# EAGLE design QTouchShield (EAGLE 6.2)
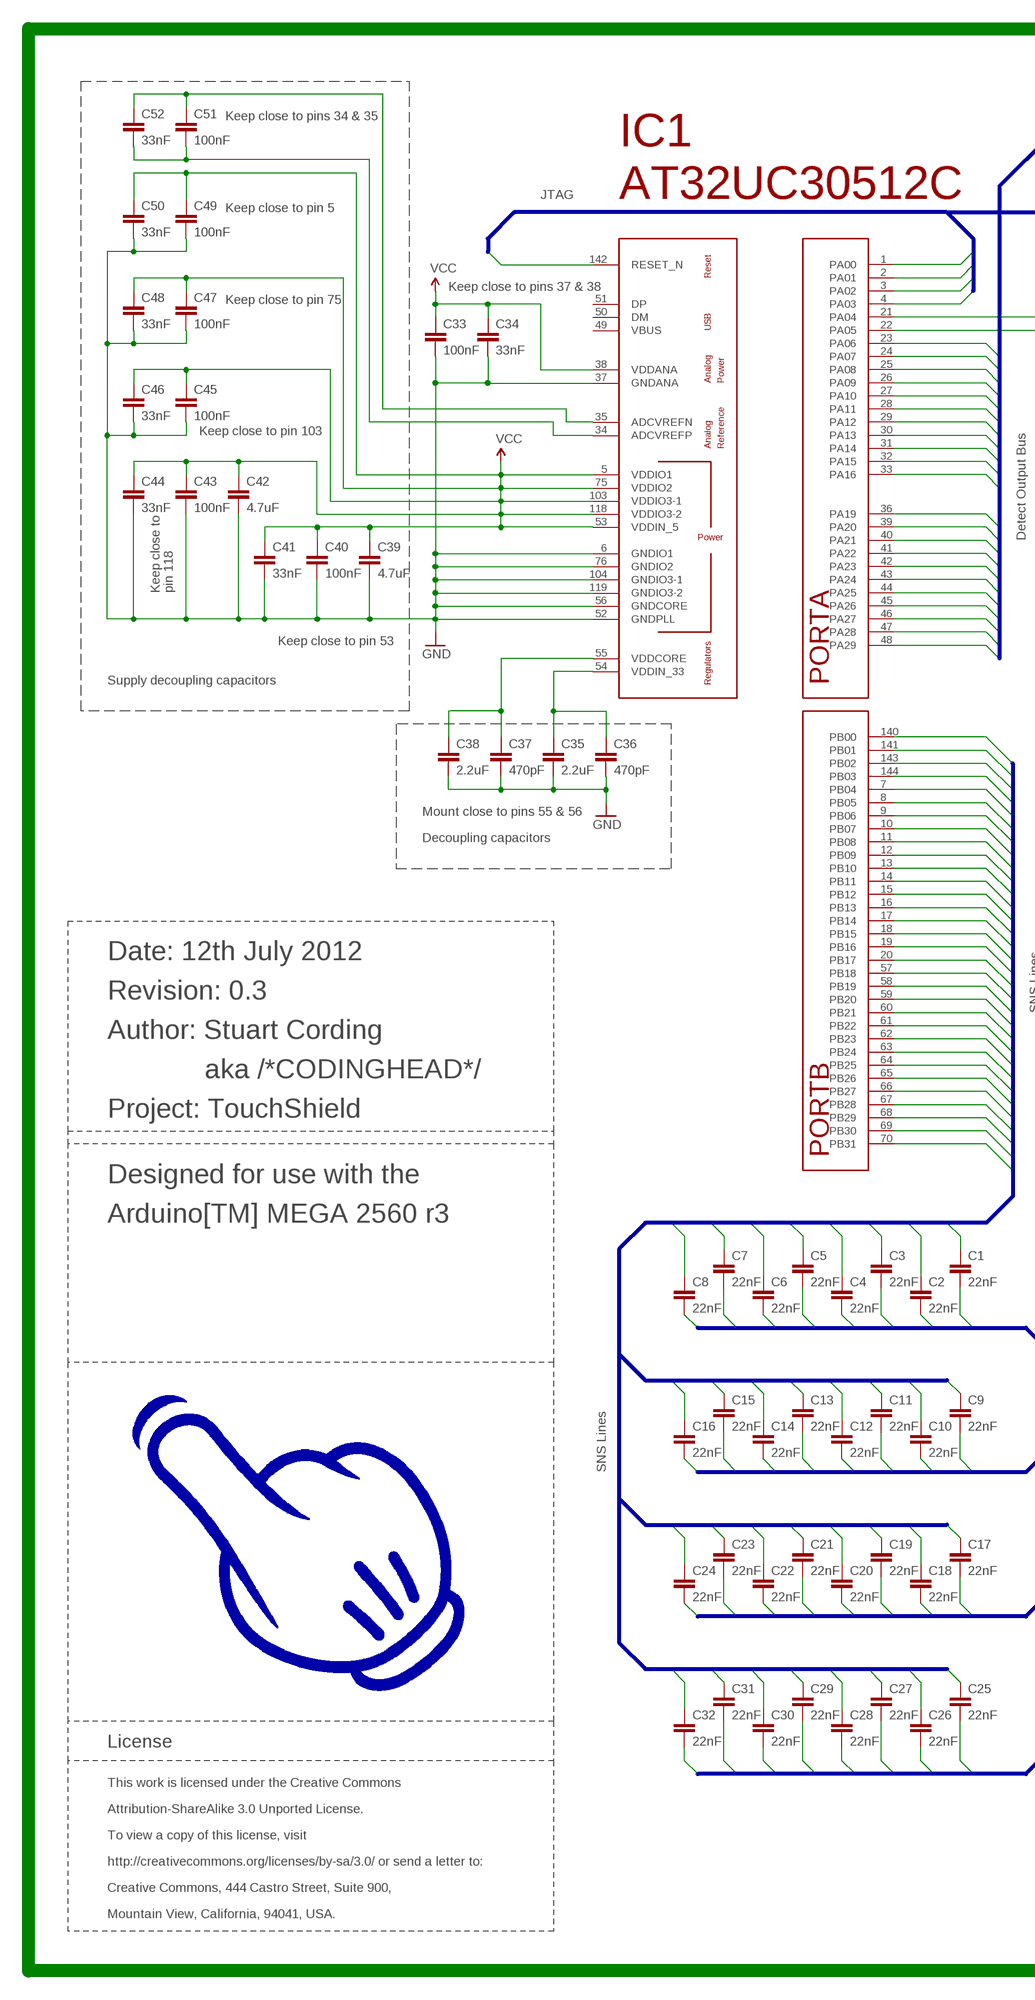
[diagram p0: schematic, sheet 1, part 1 of 2]
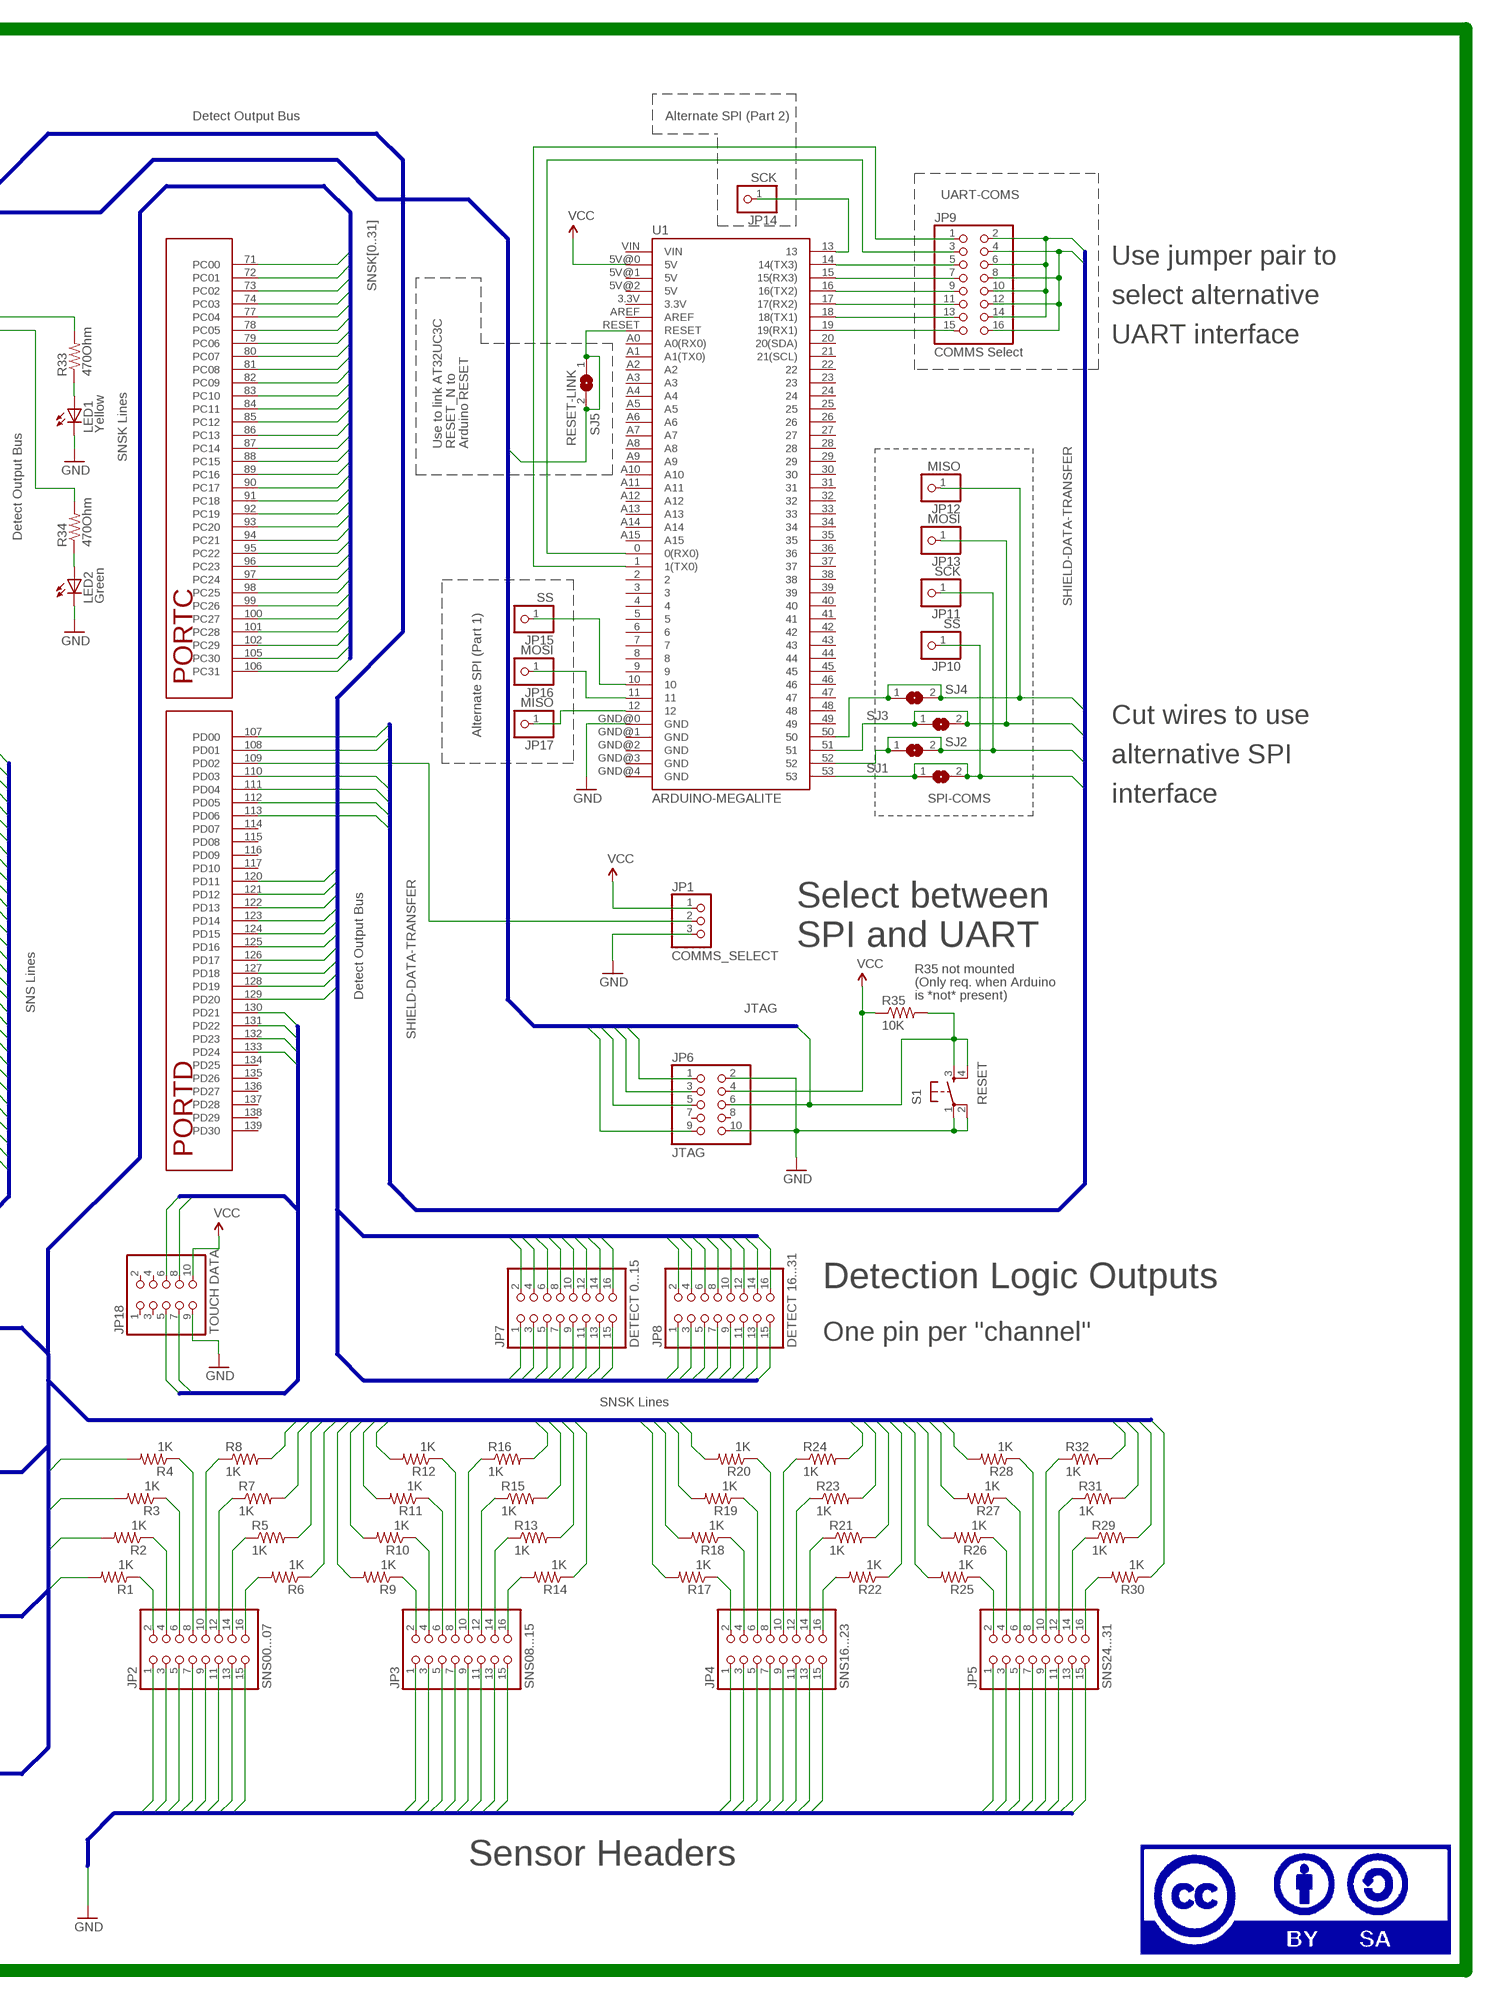
[diagram p1: schematic, sheet 1, part 2 of 2]

## Parts
C1  22nF  CAP0805  [0805]
C2  22nF  CAP0805  [0805]
C3  22nF  CAP0805  [0805]
C4  22nF  CAP0805  [0805]
C5  22nF  CAP0805  [0805]
C6  22nF  CAP0805  [0805]
C7  22nF  CAP0805  [0805]
C8  22nF  CAP0805  [0805]
C9  22nF  CAP0805  [0805]
C10  22nF  CAP0805  [0805]
C11  22nF  CAP0805  [0805]
C12  22nF  CAP0805  [0805]
C13  22nF  CAP0805  [0805]
C14  22nF  CAP0805  [0805]
C15  22nF  CAP0805  [0805]
C16  22nF  CAP0805  [0805]
C17  22nF  CAP0805  [0805]
C18  22nF  CAP0805  [0805]
C19  22nF  CAP0805  [0805]
C20  22nF  CAP0805  [0805]
C21  22nF  CAP0805  [0805]
C22  22nF  CAP0805  [0805]
C23  22nF  CAP0805  [0805]
C24  22nF  CAP0805  [0805]
C25  22nF  CAP0805  [0805]
C26  22nF  CAP0805  [0805]
C27  22nF  CAP0805  [0805]
C28  22nF  CAP0805  [0805]
C29  22nF  CAP0805  [0805]
C30  22nF  CAP0805  [0805]
C31  22nF  CAP0805  [0805]
C32  22nF  CAP0805  [0805]
C33  100nF  CAP0805  [0805]
C34  33nF  CAP0805  [0805]
C35  2.2uF  CAP1210  [1210]
C36  470pF  CAP0805  [0805]
C37  470pF  CAP0805  [0805]
C38  2.2uF  CAP1210  [1210]
C39  4.7uF  CAP1210  [1210]
C40  100nF  CAP0805  [0805]
C41  33nF  CAP0805  [0805]
C42  4.7uF  CAP1210  [1210]
C43  100nF  CAP0805  [0805]
C44  33nF  CAP0805  [0805]
C45  100nF  CAP0805  [0805]
C46  33nF  CAP0805  [0805]
C47  100nF  CAP0805  [0805]
C48  33nF  CAP0805  [0805]
C49  100nF  CAP0805  [0805]
C50  33nF  CAP0805  [0805]
C51  100nF  CAP0805  [0805]
C52  33nF  CAP0805  [0805]
IC1  AT32UC3C0512CJEDEC-MS-026  [LQFP144]
JP1  COMMS_SELECT  PINHD-1X3  [1X03]
JP2  SNS00...07  PINHD-2X8  [2X08]
JP3  SNS08...15  PINHD-2X8  [2X08]
JP4  SNS16...23  PINHD-2X8  [2X08]
JP5  SNS24...31  PINHD-2X8  [2X08]
JP6  JTAG  PINHD-2X5  [2X05]
JP7  DETECT 0...15  PINHD-2X8  [2X08]
JP8  DETECT 16...31  PINHD-2X8  [2X08]
JP9  COMMS Select  PINHD-2X8  [2X08]
JP10  SS  PINHD-1X1  [1X01]
JP11  SCK  PINHD-1X1  [1X01]
JP12  MISO  PINHD-1X1  [1X01]
JP13  MOSI  PINHD-1X1  [1X01]
JP14  SCK  PINHD-1X1  [1X01]
JP15  SS  PINHD-1X1  [1X01]
JP16  MOSI  PINHD-1X1  [1X01]
JP17  MISO  PINHD-1X1  [1X01]
JP18  TOUCH DATA  PINHD-2X5  [2X05]
LED1  Yellow  LED1206  [LED-1206]
LED2  Green  LED1206  [LED-1206]
R1  1K  RESISTOR0805-RES  [0805]
R2  1K  RESISTOR0805-RES  [0805]
R3  1K  RESISTOR0805-RES  [0805]
R4  1K  RESISTOR0805-RES  [0805]
R5  1K  RESISTOR0805-RES  [0805]
R6  1K  RESISTOR0805-RES  [0805]
R7  1K  RESISTOR0805-RES  [0805]
R8  1K  RESISTOR0805-RES  [0805]
R9  1K  RESISTOR0805-RES  [0805]
R10  1K  RESISTOR0805-RES  [0805]
R11  1K  RESISTOR0805-RES  [0805]
R12  1K  RESISTOR0805-RES  [0805]
R13  1K  RESISTOR0805-RES  [0805]
R14  1K  RESISTOR0805-RES  [0805]
R15  1K  RESISTOR0805-RES  [0805]
R16  1K  RESISTOR0805-RES  [0805]
R17  1K  RESISTOR0805-RES  [0805]
R18  1K  RESISTOR0805-RES  [0805]
R19  1K  RESISTOR0805-RES  [0805]
R20  1K  RESISTOR0805-RES  [0805]
R21  1K  RESISTOR0805-RES  [0805]
R22  1K  RESISTOR0805-RES  [0805]
R23  1K  RESISTOR0805-RES  [0805]
R24  1K  RESISTOR0805-RES  [0805]
R25  1K  RESISTOR0805-RES  [0805]
R26  1K  RESISTOR0805-RES  [0805]
R27  1K  RESISTOR0805-RES  [0805]
R28  1K  RESISTOR0805-RES  [0805]
R29  1K  RESISTOR0805-RES  [0805]
R30  1K  RESISTOR0805-RES  [0805]
R31  1K  RESISTOR0805-RES  [0805]
R32  1K  RESISTOR0805-RES  [0805]
R33  470Ohm  RESISTOR0805-RES  [0805]
R34  470Ohm  RESISTOR0805-RES  [0805]
R35  10K  RESISTOR0805-RES  [0805]
S1  RESET  TAC_SWITCHSMD  [TACTILE_SWITCH_SMD]
SJ1  SJ  [SJ]
SJ2  SJ  [SJ]
SJ3  SJ  [SJ]
SJ4  SJ  [SJ]
SJ5  RESET-LINK  SJ  [SJ]
U1  ARDUINO-MEGALITE  [ARDUINO_MEGA_LITE]

## Nets
ADCVREFN: C51.1 C52.1 IC1.35(ADCVREFN)
ADCVREFP: C51.2 C52.2 IC1.34(ADCVREFP)
GND: C33.2 C34.2 C35.2 C36.2 C37.2 C38.2 C39.2 C40.2 C41.2 C42.2 C43.2 C44.2 C45.2 C46.2 C47.2 C48.2 C49.2 C50.2 IC1.6(GNDIO1) IC1.37(GNDANA) IC1.52(GNDPLL) IC1.56(GNDCORE) IC1.76(GNDIO2) IC1.104(GNDIO3-1) IC1.119(GNDIO3-2) JP1.3 JP2.1 JP2.3 JP2.5 JP2.7 JP2.9 JP2.11 JP2.13 JP2.15 JP3.1 JP3.3 JP3.5 JP3.7 JP3.9 JP3.11 JP3.13 JP3.15 JP4.1 JP4.3 JP4.5 JP4.7 JP4.9 JP4.11 JP4.13 JP4.15 JP5.1 JP5.3 JP5.5 JP5.7 JP5.9 JP5.11 JP5.13 JP5.15 JP6.2 JP6.10 JP18.9 LED1.C LED2.C S1.1 S1.2 U1.GND@0(GND)
JTAG_RESET: IC1.142(RESET_N) JP6.6 R35.2 S1.3 S1.4 SJ5.1 SJ5.2 U1.RESET
JTAG_TCK: IC1.1(PA00) JP6.1
JTAG_TDI: IC1.2(PA01) JP6.9
JTAG_TDO: IC1.3(PA02) JP6.3
JTAG_TMS: IC1.4(PA03) JP6.5
N$1: LED1.A R33.1
N$2: JP2.2 R1.1
N$3: JP2.4 R2.1
N$4: JP2.6 R3.1
N$5: JP2.8 R4.1
N$6: JP2.10 R8.1
N$7: JP2.12 R7.1
N$8: JP2.14 R5.1
N$9: JP2.16 R6.2
N$10: JP3.2 R9.1
N$11: JP3.4 R10.1
N$12: JP3.6 R11.1
N$13: JP3.8 R12.1
N$14: JP3.10 R16.1
N$15: JP3.12 R15.1
N$16: JP3.14 R13.1
N$17: JP3.16 R14.2
N$18: JP4.2 R17.1
N$19: JP4.4 R18.1
N$20: JP4.6 R19.1
N$21: JP4.8 R20.1
N$22: JP4.10 R24.1
N$23: JP4.12 R23.1
N$24: JP4.14 R21.1
N$25: JP4.16 R22.2
N$26: JP5.2 R25.1
N$27: JP5.4 R26.1
N$28: JP5.6 R27.1
N$29: JP5.8 R28.1
N$30: JP5.10 R32.1
N$31: JP5.12 R31.1
N$32: JP5.14 R29.1
N$33: JP5.16 R30.2
N$42: LED2.A R34.1
QT-DETECT-GENERAL: IC1.21(PA04) R33.2
RX0: JP9.3 U1.0(0(RX0))
RX1: JP9.15 U1.19(19(RX1))
RX2: JP9.11 U1.17(17(RX2))
RX3: JP9.7 U1.15(15(RX3))
SDT-SPI0-MISO: IC1.112(PD05) JP12.1 SJ4.1 SJ4.2 U1.50
SDT-SPI0-MOSI: IC1.111(PD04) JP13.1 SJ3.1 SJ3.2 U1.51
SDT-SPI0-SCK: IC1.113(PD06) JP11.1 SJ2.1 SJ2.2 U1.52
SDT-SPI0-SS: IC1.110(PD03) JP10.1 SJ1.1 SJ1.2 U1.53
SDT-USART0-RXD: IC1.108(PD01) JP9.4 JP9.8 JP9.12 JP9.16
SDT-USART0-TXD: IC1.107(PD00) JP9.2 JP9.6 JP9.10 JP9.14
SHIELD-DATA-TRANSFER-COM-SELECT: IC1.109(PD02) JP1.2
SHIELD-DATA-TRANSFER-VISUAL-OUTPUT: IC1.22(PA05) R34.2
SHIELD-DETECT0: IC1.23(PA06) JP7.1
SHIELD-DETECT1: IC1.24(PA07) JP7.2
SHIELD-DETECT2: IC1.25(PA08) JP7.3
SHIELD-DETECT3: IC1.26(PA09) JP7.4
SHIELD-DETECT4: IC1.27(PA10) JP7.5
SHIELD-DETECT5: IC1.28(PA11) JP7.6
SHIELD-DETECT6: IC1.29(PA12) JP7.7
SHIELD-DETECT7: IC1.30(PA13) JP7.8
SHIELD-DETECT8: IC1.31(PA14) JP7.9
SHIELD-DETECT9: IC1.32(PA15) JP7.10
SHIELD-DETECT10: IC1.33(PA16) JP7.11
SHIELD-DETECT11: IC1.36(PA19) JP7.12
SHIELD-DETECT12: IC1.39(PA20) JP7.13
SHIELD-DETECT13: IC1.40(PA21) JP7.14
SHIELD-DETECT14: IC1.41(PA22) JP7.15
SHIELD-DETECT15: IC1.42(PA23) JP7.16
SHIELD-DETECT16: IC1.43(PA24) JP8.1
SHIELD-DETECT17: IC1.44(PA25) JP8.2
SHIELD-DETECT18: IC1.45(PA26) JP8.3
SHIELD-DETECT19: IC1.46(PA27) JP8.4
SHIELD-DETECT20: IC1.47(PA28) JP8.5
SHIELD-DETECT21: IC1.48(PA29) JP8.6
SHIELD-DETECT22: IC1.120(PD11) JP8.7
SHIELD-DETECT23: IC1.121(PD12) JP8.8
SHIELD-DETECT24: IC1.122(PD13) JP8.9
SHIELD-DETECT25: IC1.123(PD14) JP8.10
SHIELD-DETECT26: IC1.124(PD15) JP8.11
SHIELD-DETECT27: IC1.125(PD16) JP8.12
SHIELD-DETECT28: IC1.126(PD17) JP8.13
SHIELD-DETECT29: IC1.127(PD18) JP8.14
SHIELD-DETECT30: IC1.128(PD19) JP8.15
SHIELD-DETECT31: IC1.129(PD20) JP8.16
SNS0: C1.1 IC1.140(PB00)
SNS1: C2.1 IC1.141(PB01)
SNS2: C3.1 IC1.143(PB02)
SNS3: C4.1 IC1.144(PB03)
SNS4: C5.1 IC1.7(PB04)
SNS5: C6.1 IC1.8(PB05)
SNS6: C7.1 IC1.9(PB06)
SNS7: C8.1 IC1.10(PB07)
SNS8: C9.1 IC1.11(PB08)
SNS9: C10.1 IC1.12(PB09)
SNS10: C11.1 IC1.13(PB10)
SNS11: C12.1 IC1.14(PB11)
SNS12: C13.1 IC1.15(PB12)
SNS13: C14.1 IC1.16(PB13)
SNS14: C15.1 IC1.17(PB14)
SNS15: C16.1 IC1.18(PB15)
SNS16: C17.1 IC1.19(PB16)
SNS17: C18.1 IC1.20(PB17)
SNS18: C19.1 IC1.57(PB18)
SNS19: C20.1 IC1.58(PB19)
SNS20: C21.1 IC1.59(PB20)
SNS21: C22.1 IC1.60(PB21)
SNS22: C23.1 IC1.61(PB22)
SNS23: C24.1 IC1.62(PB23)
SNS24: C25.1 IC1.63(PB24)
SNS25: C26.1 IC1.64(PB25)
SNS26: C27.1 IC1.65(PB26)
SNS27: C28.1 IC1.66(PB27)
SNS28: C29.1 IC1.67(PB28)
SNS29: C30.1 IC1.68(PB29)
SNS30: C31.1 IC1.69(PB30)
SNS31: C32.1 IC1.70(PB31)
SNSK0: C1.2 IC1.71(PC00) R1.2
SNSK1: C2.2 IC1.72(PC01) R2.2
SNSK2: C3.2 IC1.73(PC02) R3.2
SNSK3: C4.2 IC1.74(PC03) R4.2
SNSK4: C5.2 IC1.77(PC04) R8.2
SNSK5: C6.2 IC1.78(PC05) R7.2
SNSK6: C7.2 IC1.79(PC06) R5.2
SNSK7: C8.2 IC1.80(PC07) R6.1
SNSK8: C9.2 IC1.81(PC08) R9.2
SNSK9: C10.2 IC1.82(PC09) R10.2
SNSK10: C11.2 IC1.83(PC10) R11.2
SNSK11: C12.2 IC1.84(PC11) R12.2
SNSK12: C13.2 IC1.85(PC12) R16.2
SNSK13: C14.2 IC1.86(PC13) R15.2
SNSK14: C15.2 IC1.87(PC14) R13.2
SNSK15: C16.2 IC1.88(PC15) R14.1
SNSK16: C17.2 IC1.89(PC16) R17.2
SNSK17: C18.2 IC1.90(PC17) R18.2
SNSK18: C19.2 IC1.91(PC18) R19.2
SNSK19: C20.2 IC1.92(PC19) R20.2
SNSK20: C21.2 IC1.93(PC20) R24.2
SNSK21: C22.2 IC1.94(PC21) R23.2
SNSK22: C23.2 IC1.95(PC22) R21.2
SNSK23: C24.2 IC1.96(PC23) R22.1
SNSK24: C25.2 IC1.97(PC24) R25.2
SNSK25: C26.2 IC1.98(PC25) R26.2
SNSK26: C27.2 IC1.99(PC26) R27.2
SNSK27: C28.2 IC1.100(PC27) R28.2
SNSK28: C29.2 IC1.101(PC28) R32.2
SNSK29: C30.2 IC1.102(PC29) R31.2
SNSK30: C31.2 IC1.105(PC30) R29.2
SNSK31: C32.2 IC1.106(PC31) R30.1
SPI-MISO-ALT: JP17.1 U1.12
SPI-MOSI-ALT: JP16.1 U1.11
SPI-SCK-ALT: JP14.1 U1.13
SPI-SS-ALT: JP15.1 U1.10
TOUCH_DATA-MISO: IC1.133(PD24) JP18.7
TOUCH_DATA-MOSI: IC1.132(PD23) JP18.6
TOUCH_DATA-SCK: IC1.131(PD22) JP18.8
TOUCH_DATA-SS: IC1.130(PD21) JP18.5
TX0: JP9.1 U1.1(1(TX0))
TX1: JP9.13 U1.18(18(TX1))
TX2: JP9.9 U1.16(16(TX2))
TX3: JP9.5 U1.14(14(TX3))
VCC: C33.1 C34.1 C39.1 C40.1 C41.1 C42.1 C43.1 C44.1 C45.1 C46.1 C47.1 C48.1 C49.1 C50.1 IC1.5(VDDIO1) IC1.38(VDDANA) IC1.53(VDDIN_5) IC1.75(VDDIO2) IC1.103(VDDIO3-1) IC1.118(VDDIO3-2) JP1.1 JP6.4 JP18.10 R35.1 U1.5V@0(5V)
VDDCORE: C37.1 C38.1 IC1.55(VDDCORE)
VDDIN_33: C35.1 C36.1 IC1.54(VDDIN_33)
Unconnected: IC1.49(VBUS) IC1.50(DM) IC1.51(DP) IC1.114(PD07) IC1.115(PD08) IC1.116(PD09) IC1.117(PD10) IC1.134(PD25) IC1.135(PD26) IC1.136(PD27) IC1.137(PD28) IC1.138(PD29) IC1.139(PD30) JP6.7 JP6.8 JP18.1 JP18.2 JP18.3 JP18.4 U1.2 U1.3 U1.3.3V U1.4 U1.5 U1.5V@1(5V) U1.5V@2(5V) U1.6 U1.7 U1.8 U1.9 U1.20(20(SDA)) U1.21(21(SCL)) U1.22 U1.23 U1.24 U1.25 U1.26 U1.27 U1.28 U1.29 U1.30 U1.31 U1.32 U1.33 U1.34 U1.35 U1.36 U1.37 U1.38 U1.39 U1.40 U1.41 U1.42 U1.43 U1.44 U1.45 U1.46 U1.47 U1.48 U1.49 U1.A0(A0(RX0)) U1.A1(A1(TX0)) U1.A2 U1.A3 U1.A4 U1.A5 U1.A6 U1.A7 U1.A8 U1.A9 U1.A10 U1.A11 U1.A12 U1.A13 U1.A14 U1.A15 U1.AREF U1.GND@1(GND) U1.GND@2(GND) U1.GND@3(GND) U1.GND@4(GND) U1.VIN

## Buses
SNS[0..31]
SNSK[0..31]
GND
JTAG_TCK,JTAG_TDI,JTAG_TDO,JTAG_TMS,JTAG_RESET
SHIELD-DETECT[0..31]
SDT-USART0-TXD,SDT-USART0-RXD,SDT-SPI0-SS,SDT-SPI0-MOSI,SDT-SPI0-MISO,SDT-SPI0-SCK
TOUCH_DATA-SS,TOUCH_DATA-SCK,TOUCH_DATA-MOSI,TOUCH_DATA-MISO

## Notes on the sheet
- Keep close to pins 34 & 35 | Detect Output Bus | Alternate SPI (Part 2)
- JTAG | UART-COMS
- Keep close to pin 5
- Use jumper pair to
- Keep close to pins 37 & 38
- Keep close to pin 75 | select alternative
- UART interface
- Keep close to pin 103
- Use to link AT32UC3C | RESET_N to | Arduino RESET
- SNSK Lines
- Detect Output Bus
- Keep close to | pin 118
- SHIELD-DATA-TRANSFER
- Keep close to pin 53
- Supply decoupling capacitors
- Cut wires to use
- Alternate SPI (Part 1)
- alternative SPI
- SPI-COMS | interface
- Mount close to pins 55 & 56
- Decoupling capacitors
- Select between
- SPI and UART
- Date: 12th July 2012
- R35 not mounted
- (Only req. when Arduino
- Revision: 0.3 | Detect Output Bus | is *not* present)
- SNS Lines | JTAG
- Author: Stuart Cording | SHIELD-DATA-TRANSFER
- aka /*CODINGHEAD*/
- Project: TouchShield
- Designed for use with the
- Arduino[TM] MEGA 2560 r3
- Detection Logic Outputs
- One pin per "channel"
- SNSK Lines
- SNS Lines
- License
- This work is licensed under the Creative Commons
- Attribution-ShareAlike 3.0 Unported License.
- To view a copy of this license, visit
- http://creativecommons.org/licenses/by-sa/3.0/ or send a letter to: | Sensor Headers
- Creative Commons, 444 Castro Street, Suite 900,
- Mountain View, California, 94041, USA.

## Library data of the parts
C1-C52 = SparkFun:CAP: Capacitor Standard 0603 ceramic capacitor, and 0.1" leaded capacitor.
IC1 = atmel-AVR32:AT32UC3C0512C: AT32UC3C0512C - AVR32 Microcontroller from Atmel
JP1 = pinhead:PINHD-1X3: PIN HEADER
JP2-JP5 JP7-JP9 = pinhead:PINHD-2X8: PIN HEADER
JP6 JP18 = pinhead:PINHD-2X5: PIN HEADER
JP10-JP17 = pinhead:PINHD-1X1: PIN HEADER
LED1 LED2 = SparkFun:LED: LEDs Standard schematic elements and footprints for 5mm, 3mm, 1206, and 0603 sized LEDs. 5mm - Spark Fun Electronics SKU : COM-00529 (and others)
R1-R35 = SparkFun:RESISTOR: Resistor Basic schematic elements and footprints for 0603, 1206, and PTH resistors.
S1 = SparkFun:TAC_SWITCH: Momentary Switch Button commonly used for reset or general input. Spark Fun Electronics SKU : COM-00097
SJ1-SJ5 = jumper:SJ: SMD solder JUMPER
U1 = SparkFun:ARDUINO-MEGA: Arduino Mega footprint connections

## Board
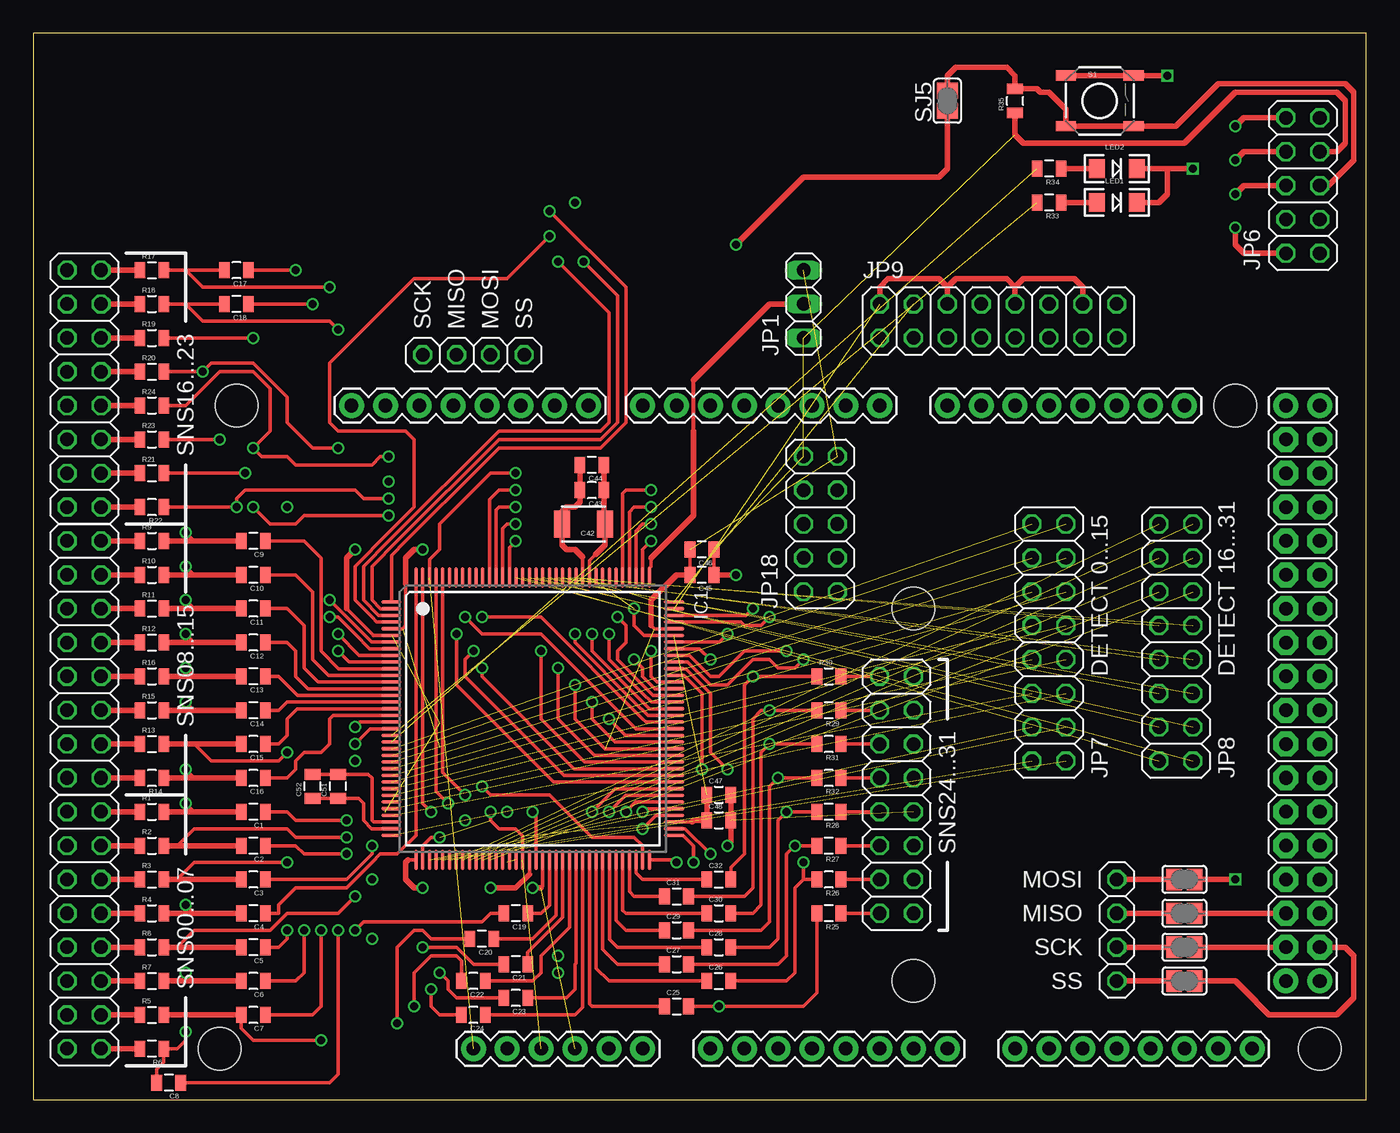
[diagram p2: board, top side]
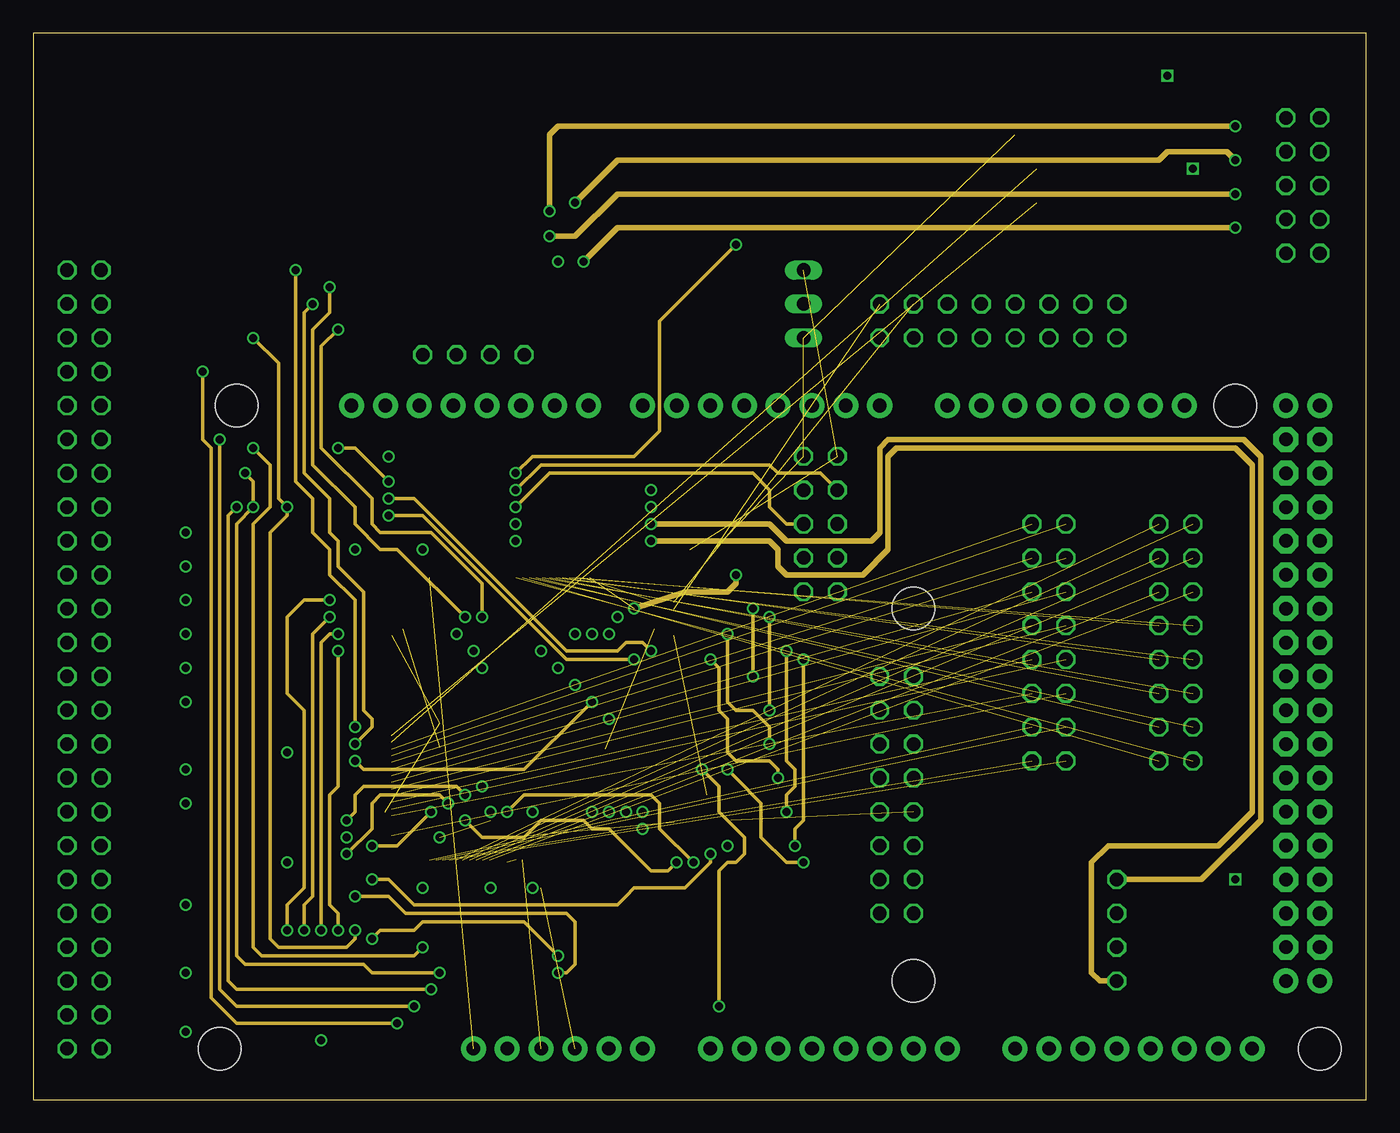
[diagram p3: board, inner layer Route2]
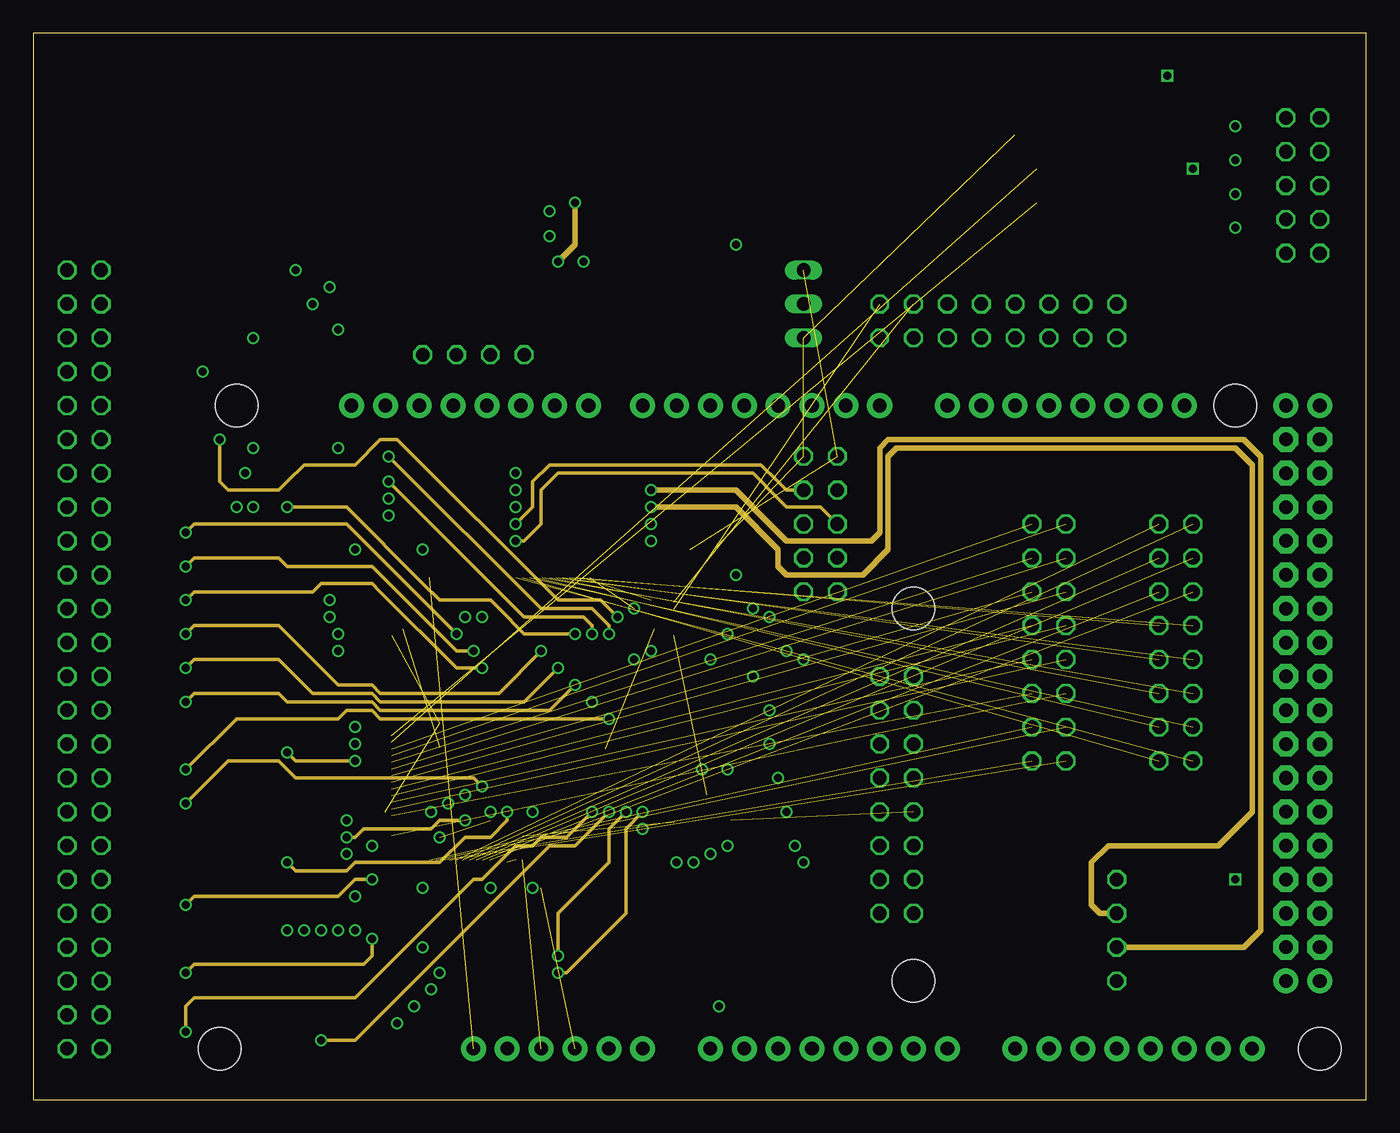
[diagram p4: board, inner layer Route15]
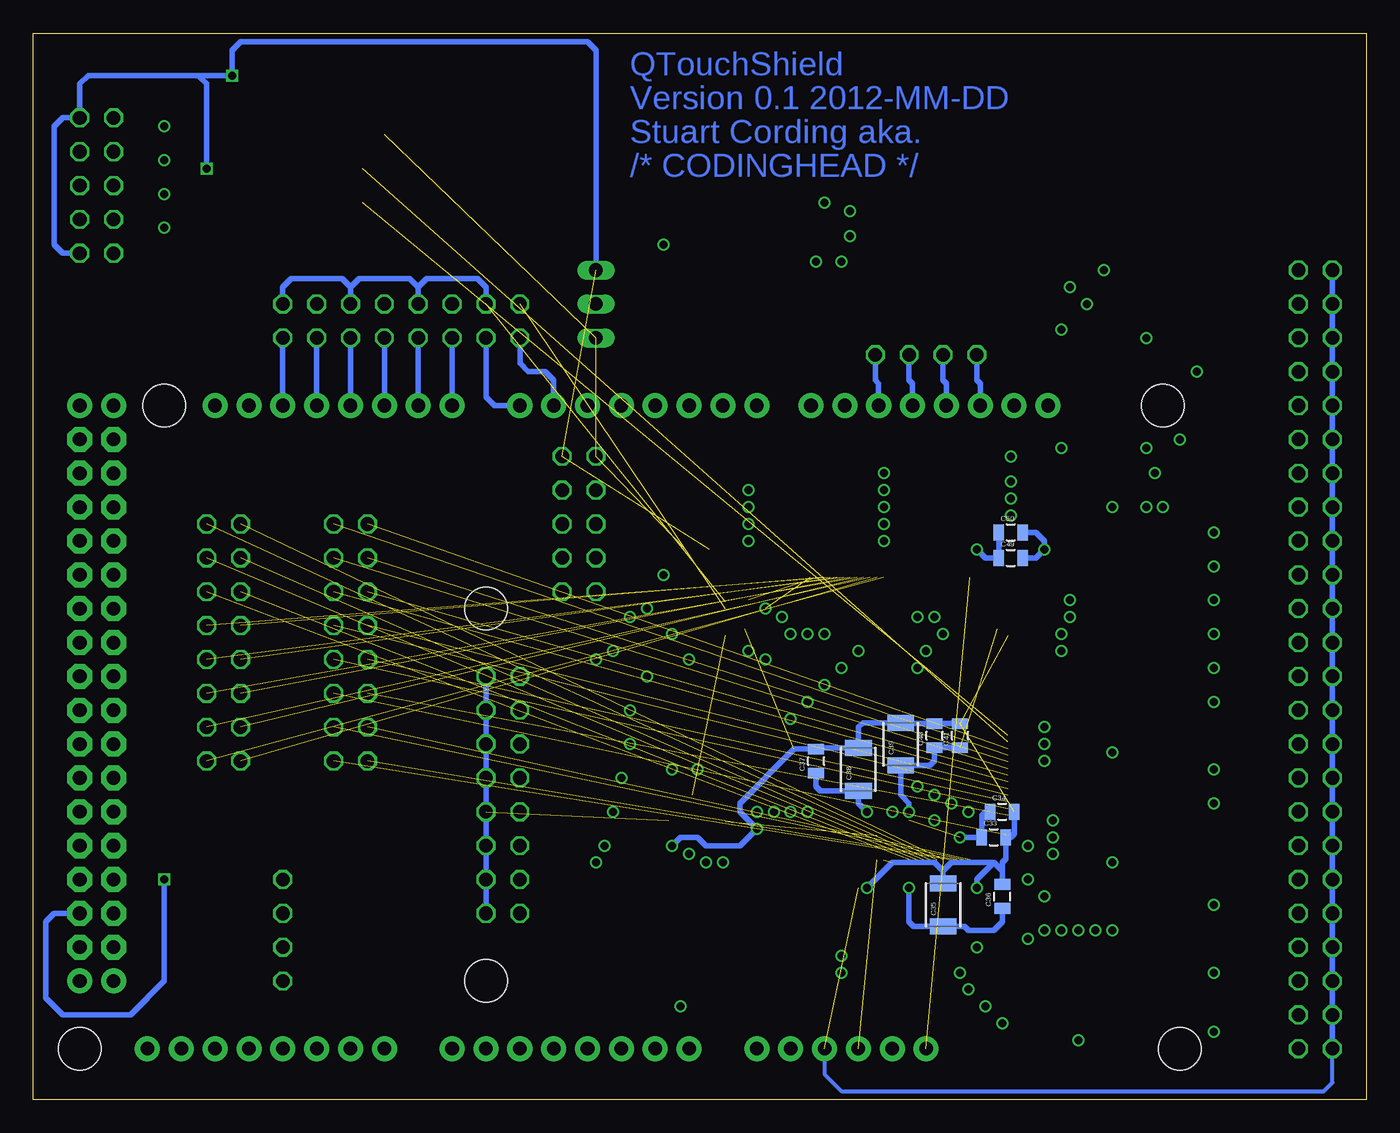
[diagram p5: board, bottom side, seen from below]

Size 100 x 80 mm. Coordinates in mm from the lower left corner, seen from the top.
Outline: 0,0 100,0 100,80 0,80 0,0
Copper layers (1*2+15*16): Top 0.035mm / dielectric 0.38mm / Route2 0.035mm / dielectric 0.71mm / Route15 0.035mm / dielectric 0.38mm / Bottom 0.035mm
Design rules: minimum track width 0.15mm, minimum drill 0.3mm, track to track 0.15mm, track to pad 0.15mm, pad to pad 0.15mm, via to via 0.15mm, smd to smd 0.15mm, copper to edge 0.3mm, drill to drill 0.2mm, minimum pad ring 0.2mm, minimum via ring 0.15mm, stop-mask expansion 0.075mm, vias tented up to drill 0mil, thermal gap 0.2mm

### Footprints (pad centres in the part's own frame; a part is rotated, then mirrored left to right if it is on the bottom)
0805 = smd 0.8 x 1.2: 1 -0.9,0; 2 0.9,0
1210 = smd 1.2 x 2: 1 -1.6,0; 2 1.6,0
LQFP144 = smd 0.25 x 1.5: 1 -8.75,-10.6; 2 -8.25,-10.6; 3 -7.75,-10.6; 4 -7.25,-10.6; 5 -6.75,-10.6; 6 -6.25,-10.6; 7 -5.75,-10.6; 8 -5.25,-10.6; 9 -4.75,-10.6; 10 -4.25,-10.6; 11 -3.75,-10.6; 12 -3.25,-10.6; 13 -2.75,-10.6; 14 -2.25,-10.6; 15 -1.75,-10.6; 16 -1.25,-10.6; 17 -0.75,-10.6; 18 -0.25,-10.6; 19 0.25,-10.6; 20 0.75,-10.6; 21 1.25,-10.6; 22 1.75,-10.6; 23 2.25,-10.6; 24 2.75,-10.6; 25 3.25,-10.6; 26 3.75,-10.6; 27 4.25,-10.6; 28 4.75,-10.6; 29 5.25,-10.6; 30 5.75,-10.6; 31 6.25,-10.6; 32 6.75,-10.6; 33 7.25,-10.6; 34 7.75,-10.6; 35 8.25,-10.6; 36 8.75,-10.6; 73 8.75,10.6; 74 8.25,10.6; 75 7.75,10.6; 76 7.25,10.6; 77 6.75,10.6; 78 6.25,10.6; 79 5.75,10.6; 80 5.25,10.6; 81 4.75,10.6; 82 4.25,10.6; 83 3.75,10.6; 84 3.25,10.6; 85 2.75,10.6; 86 2.25,10.6; 87 1.75,10.6; 88 1.25,10.6; 89 0.75,10.6; 90 0.25,10.6; 91 -0.25,10.6; 92 -0.75,10.6; 93 -1.25,10.6; 94 -1.75,10.6; 95 -2.25,10.6; 96 -2.75,10.6; 97 -3.25,10.6; 98 -3.75,10.6; 99 -4.25,10.6; 100 -4.75,10.6; 101 -5.25,10.6; 102 -5.75,10.6; 103 -6.25,10.6; 104 -6.75,10.6; 105 -7.25,10.6; 106 -7.75,10.6; 107 -8.25,10.6; 108 -8.75,10.6 | smd 1.5 x 0.25: 37 10.6,-8.75; 38 10.6,-8.25; 39 10.6,-7.75; 40 10.6,-7.25; 41 10.6,-6.75; 42 10.6,-6.25; 43 10.6,-5.75; 44 10.6,-5.25; 45 10.6,-4.75; 46 10.6,-4.25; 47 10.6,-3.75; 48 10.6,-3.25; 49 10.6,-2.75; 50 10.6,-2.25; 51 10.6,-1.75; 52 10.6,-1.25; 53 10.6,-0.75; 54 10.6,-0.25; 55 10.6,0.25; 56 10.6,0.75; 57 10.6,1.25; 58 10.6,1.75; 59 10.6,2.25; 60 10.6,2.75; 61 10.6,3.25; 62 10.6,3.75; 63 10.6,4.25; 64 10.6,4.75; 65 10.6,5.25; 66 10.6,5.75; 67 10.6,6.25; 68 10.6,6.75; 69 10.6,7.25; 70 10.6,7.75; 71 10.6,8.25; 72 10.6,8.75; 109 -10.6,8.75; 110 -10.6,8.25; 111 -10.6,7.75; 112 -10.6,7.25; 113 -10.6,6.75; 114 -10.6,6.25; 115 -10.6,5.75; 116 -10.6,5.25; 117 -10.6,4.75; 118 -10.6,4.25; 119 -10.6,3.75; 120 -10.6,3.25; 121 -10.6,2.75; 122 -10.6,2.25; 123 -10.6,1.75; 124 -10.6,1.25; 125 -10.6,0.75; 126 -10.6,0.25; 127 -10.6,-0.25; 128 -10.6,-0.75; 129 -10.6,-1.25; 130 -10.6,-1.75; 131 -10.6,-2.25; 132 -10.6,-2.75; 133 -10.6,-3.25; 134 -10.6,-3.75; 135 -10.6,-4.25; 136 -10.6,-4.75; 137 -10.6,-5.25; 138 -10.6,-5.75; 139 -10.6,-6.25; 140 -10.6,-6.75; 141 -10.6,-7.25; 142 -10.6,-7.75; 143 -10.6,-8.25; 144 -10.6,-8.75
1X03 = drill 1.016 long: 1 -2.54,0; 2 0,0; 3 2.54,0
2X08 = drill 1.016 octagon: 1 -8.89,-1.27; 2 -8.89,1.27; 3 -6.35,-1.27; 4 -6.35,1.27; 5 -3.81,-1.27; 6 -3.81,1.27; 7 -1.27,-1.27; 8 -1.27,1.27; 9 1.27,-1.27; 10 1.27,1.27; 11 3.81,-1.27; 12 3.81,1.27; 13 6.35,-1.27; 14 6.35,1.27; 15 8.89,-1.27; 16 8.89,1.27
2X05 = drill 1.016 octagon: 1 -5.08,-1.27; 2 -5.08,1.27; 3 -2.54,-1.27; 4 -2.54,1.27; 5 0,-1.27; 6 0,1.27; 7 2.54,-1.27; 8 2.54,1.27; 9 5.08,-1.27; 10 5.08,1.27
1X01 = drill 1.016 octagon: 1 0,0
LED-1206 = smd 1.2 x 1.4: A -1.5,0; C 1.5,0
TACTILE_SWITCH_SMD = smd 1.524 x 0.762: 1 -2.54,1.905; 2 2.54,1.905; 3 -2.54,-1.905; 4 2.54,-1.905
SJ = smd 1.168 x 1.6: 1 -0.762,0; 2 0.762,0
ARDUINO_MEGA_LITE = drill 1.016 pad 1.88: 0 48.26,0; 1 45.72,0; 2 43.18,0; 3 40.64,0; 3.3V 20.32,-48.26; 4 38.1,0; 5 35.56,0; 5V@0 22.86,-48.26; 5V@1 78.74,0; 5V@2 81.28,0; 6 33.02,0; 7 30.48,0; 8 26.416,0; 9 23.876,0; 10 21.336,0; 11 18.796,0; 12 16.256,0; 13 13.716,0; 14 53.34,0; 15 55.88,0; 16 58.42,0; 17 60.96,0; 18 63.5,0; 19 66.04,0; 20 68.58,0; 21 71.12,0; A0 35.56,-48.26; A1 38.1,-48.26; A2 40.64,-48.26; A3 43.18,-48.26; A4 45.72,-48.26; A5 48.26,-48.26; A6 50.8,-48.26; A7 53.34,-48.26; A8 58.42,-48.26; A9 60.96,-48.26; A10 63.5,-48.26; A11 66.04,-48.26; A12 68.58,-48.26; A13 71.12,-48.26; A14 73.66,-48.26; A15 76.2,-48.26; AREF 8.636,0; GND@0 25.4,-48.26; GND@1 27.94,-48.26; GND@2 78.74,-43.18; GND@3 81.28,-43.18; GND@4 11.176,0; RESET 17.78,-48.26; VIN 30.48,-48.26 | drill 1.016 pad 1.88 octagon: 22 78.74,-2.54; 23 81.28,-2.54; 24 78.74,-5.08; 25 81.28,-5.08; 26 78.74,-7.62; 27 81.28,-7.62; 28 78.74,-10.16; 29 81.28,-10.16; 30 78.74,-12.7; 31 81.28,-12.7; 32 78.74,-15.24; 33 81.28,-15.24; 34 78.74,-17.78; 35 81.28,-17.78; 36 78.74,-20.32; 37 81.28,-20.32; 38 78.74,-22.86; 39 81.28,-22.86; 40 78.74,-25.4; 41 81.28,-25.4; 42 78.74,-27.94; 43 81.28,-27.94; 44 78.74,-30.48; 45 81.28,-30.48; 46 78.74,-33.02; 47 81.28,-33.02; 48 78.74,-35.56; 49 81.28,-35.56; 50 78.74,-38.1; 51 81.28,-38.1; 52 78.74,-40.64; 53 81.28,-40.64 | hole 3.2: 0,0; -1.27,-48.26; 50.8,-15.24; 50.8,-43.18; 74.93,0; 81.28,-48.26

### Placement (x,y rotation side)
C1  16.51,21.59 180 top
C2  16.51,19.05 180 top
C3  16.51,16.51 180 top
C4  16.51,13.97 180 top
C5  16.51,11.43 180 top
C6  16.51,8.89 180 top
C7  16.51,6.35 180 top
C8  10.16,1.27 180 top
C9  16.51,41.91 180 top
C10  16.51,39.37 180 top
C11  16.51,36.83 180 top
C12  16.51,34.29 180 top
C13  16.51,31.75 180 top
C14  16.51,29.21 180 top
C15  16.51,26.67 180 top
C16  16.51,24.13 180 top
C17  15.24,62.23 180 top
C18  15.24,59.69 180 top
C19  36.2,13.97 180 top
C20  33.66,12.06 180 top
C21  36.2,10.16 180 top
C22  33.02,8.89 180 top
C23  36.2,7.62 180 top
C24  33.02,6.35 180 top
C25  48.26,6.99 0 top
C26  51.44,8.89 0 top
C27  48.26,10.16 0 top
C28  51.44,11.43 0 top
C29  48.26,12.7 0 top
C30  51.44,13.97 0 top
C31  48.26,15.24 0 top
C32  51.44,16.51 0 top
C33  27.94,19.68 0 bottom
C34  27.3,21.59 0 bottom
C35  31.75,14.61 90 bottom
C36  27.3,15.24 90 bottom
C37  41.27,25.4 90 bottom
C38  38.1,24.77 90 bottom
C39  34.92,26.67 90 bottom
C40  32.38,27.3 90 bottom
C41  30.48,27.3 90 bottom
C42  41.27,43.18 180 top
C43  41.91,45.72 180 top
C44  41.91,47.62 180 top
C45  50.16,39.37 180 top
C46  50.16,41.27 180 top
C47  51.44,22.86 0 top
C48  51.44,20.95 0 top
C49  26.67,40.64 0 bottom
C50  26.67,42.55 0 bottom
C51  22.86,23.5 90 top
C52  20.95,23.5 90 top
IC1  37.47,28.57 270 top
JP1  57.78,59.69 90 top
JP2  3.81,12.7 270 top
JP3  3.81,33.02 270 top
JP4  3.81,53.34 270 top
JP5  64.77,22.86 90 top
JP6  95.25,68.58 270 top
JP7  76.2,34.29 270 top
JP8  85.72,34.29 270 top
JP9  72.39,58.42 0 top
JP10  81.28,8.89 270 top
JP11  81.28,11.43 270 top
JP12  81.28,13.97 270 top
JP13  81.28,16.51 270 top
JP14  29.21,55.88 0 top
JP15  36.83,55.88 0 top
JP16  34.29,55.88 0 top
JP17  31.75,55.88 0 top
JP18  59.05,43.18 90 top
LED1  81.28,67.31 0 top
LED2  81.28,69.85 0 top
R1  8.89,21.59 0 top
R2  8.89,19.05 0 top
R3  8.89,16.51 0 top
R4  8.89,13.97 0 top
R5  8.89,6.35 0 top
R6  8.89,3.81 180 top
R7  8.89,8.89 0 top
R8  8.89,11.43 0 top
R9  8.89,41.91 0 top
R10  8.89,39.37 0 top
R11  8.89,36.83 0 top
R12  8.89,34.29 0 top
R13  8.89,26.67 0 top
R14  8.89,24.13 180 top
R15  8.89,29.21 0 top
R16  8.89,31.75 0 top
R17  8.89,62.23 0 top
R18  8.89,59.69 0 top
R19  8.89,57.15 0 top
R20  8.89,54.61 0 top
R21  8.89,46.99 0 top
R22  8.89,44.45 180 top
R23  8.89,49.53 0 top
R24  8.89,52.07 0 top
R25  59.69,13.97 180 top
R26  59.69,16.51 180 top
R27  59.69,19.05 180 top
R28  59.69,21.59 180 top
R29  59.69,29.21 180 top
R30  59.69,31.75 0 top
R31  59.69,26.67 180 top
R32  59.69,24.13 180 top
R33  76.2,67.31 180 top
R34  76.2,69.85 180 top
R35  73.66,74.93 90 top
S1  80.01,74.93 0 top
SJ1  86.36,8.89 180 top
SJ2  86.36,11.43 180 top
SJ3  86.36,16.51 180 top
SJ4  86.36,13.97 180 top
SJ5  68.58,74.93 90 top
U1  15.24,52.07 0 top

### Tracks (layer width: path | path; a pad name or v marks a point on that pad's centre or on a via)
ADCVREFN
  Top 0.254: IC1.35 25.39,20.32 24.77,20.95 24.77,22.23 24.39,22.59 C51.1 C52.1
ADCVREFP
  Top 0.254: IC1.34 25.53,20.82 25.4,20.95 25.4,24.13 25.14,24.39 C51.2 C52.2
GND  (via drill 0.6)  (9 unrouted)
  Top 0.254: IC1.6 25.5,34.83 25.4,34.92 23.5,36.83 | IC1.119 41.22,40.7 | IC1.104 46.59,35.33 46.35,35.56 | C45.2 C46.2 | IC1.76 46.73,21.32 46.35,20.95 v45.72,20.32 | 38.1,15.88 38.22,15.99 IC1.56 | 28.14,17.98 IC1.37
  Top 0.406: LED1.C 84.45,67.31 85.09,67.94 85.09,69.85 | 84.45,69.85 LED2.C 85.09,69.85 | v85.09,76.83 S1.2 S1.1 | v87,69.85 85.09,69.85 | 23.5,36.83 23.5,38.1 23.5,39.37 23.5,40.64 v24.13,41.27 | C47.2 C48.2 52.34,19.32 v52.07,19.05 | 41.22,40.7 40.64,41.27 40.01,41.27 39.67,41.6 C42.2 39.67,44.12 40.01,44.45 40.64,44.45 41.01,44.82 C43.2 C44.2 | 46.35,35.56 46.35,37.47 48.26,39.37 C45.2 | v37.47,15.88 38.1,15.88 | v29.21,15.88 28.57,15.88 27.94,16.51 27.94,17.78 28.14,17.98
  Bottom 0.305: U1.GND@0 40.64,1.91 39.37,0.64 3.17,0.64 2.54,1.27 JP2.15
  Bottom 0.406: JP4.1 JP4.3 JP4.5 JP4.7 JP4.9 JP4.11 JP4.13 JP4.15 JP3.1 JP3.3 JP3.5 JP3.7 JP3.9 JP3.11 JP3.13 JP3.15 JP2.1 JP2.3 JP2.5 JP2.7 JP2.9 JP2.11 JP2.13 JP2.15 | JP5.15 JP5.13 JP5.11 JP5.9 JP5.7 JP5.5 JP5.3 JP5.1 | JP6.10 97.79,63.5 98.42,64.14 98.42,73.03 97.79,73.66 JP6.2 96.52,76.2 95.89,76.83 87.63,76.83 | v87,69.85 87,76.2 87.63,76.83 | 87.63,76.83 v85.09,76.83 85.09,78.74 84.45,79.38 58.42,79.38 57.78,78.74 JP1.3 | v52.07,19.05 51.44,19.68 50.16,19.68 49.53,19.05 46.99,19.05 | v45.72,20.32 46.99,19.05 | C36.2 27.3,17.14 | 27.3,17.14 27.94,17.78 | 27.94,17.78 31.11,17.78 31.75,17.14 | 31.75,17.14 C35.2 31.75,17.14 | 31.75,17.14 32.38,17.78 35.56,17.78 v37.47,15.88 | 27.94,17.78 29.21,16.51 v29.21,15.88 | 46.99,19.05 v45.72,20.32 | v45.72,20.32 46.99,21.59 46.99,22.23 43.18,26.04 42.91,26.3 C37.2 41.21,26.36 C38.2 38.1,27.94 37.77,28.27 C39.2 34.86,28.2 C40.2 C41.2 | C34.2 26.41,19.95 26.67,19.68 C33.2 27.04,18.05 27.3,17.78 27.3,17.14 | C50.2 24.77,42.55 24.13,41.91 v24.13,41.27 24.77,40.64 C49.2
JTAG_RESET  (via drill 0.6)  (1 unrouted)
  Top 0.254: IC1.142 29.71,40.51 30.48,41.27 30.48,43.18 34.29,46.99 v36.2,46.99
  Top 0.406: JP6.6 97.16,68.58 99.06,70.48 99.06,75.56 98.42,76.2 88.9,76.2 85.72,73.03 S1.4 S1.3 77.47,74.3 76.2,75.56 75.56,75.56 75.3,75.83 R35.2 73.66,76.83 73.03,77.47 69.22,77.47 68.58,76.83 SJ5.2 68.71,75.56 68.58,75.56 SJ5.1 68.58,69.85 67.94,69.22 57.78,69.22 v52.7,64.14
  Route2 0.254: v36.2,46.99 37.47,48.26 45.09,48.26 46.99,50.16 46.99,58.42 v52.7,64.14
JTAG_TCK  (via drill 0.6)
  Top 0.254: IC1.1 26.86,40.84 27.94,41.91 33.66,47.62 34.92,48.9 42.55,48.9 44.45,50.8 44.45,60.96 v38.73,66.67
  Top 0.406: JP6.1 90.81,73.66 v90.17,73.03
  Route2 0.254: 39.37,73.03 41.27,73.03
  Route2 0.406: v90.17,73.03 41.27,73.03 39.37,73.03 38.73,72.39 v38.73,66.67
JTAG_TDI  (via drill 0.6)
  Top 0.254: IC1.2 26.04,36.83 25.4,37.47 25.4,40.01 27.3,41.91 34.92,49.53 42.55,49.53 43.81,50.8 43.81,60.33 v41.27,62.87
  Top 0.406: JP6.9 90.81,63.5 90.17,64.14 v90.17,65.41
  Route2 0.406: v90.17,65.41 47.62,65.41 43.81,65.41 v41.27,62.87
JTAG_TDO  (via drill 0.6)
  Top 0.254: IC1.3 25.91,36.33 24.77,37.47 24.77,40.01 26.67,41.91 34.92,50.16 42.55,50.16 43.18,50.8 43.18,59.05 v39.37,62.87
  Top 0.406: JP6.3 90.81,71.12 v90.17,70.48
  Route2 0.406: v90.17,70.48 89.53,71.12 85.09,71.12 84.45,70.48 43.81,70.48 v40.64,67.31
  Route15 0.406: v39.37,62.87 40.01,63.5 40.64,64.14 v40.64,67.31
JTAG_TMS  (via drill 0.6)
  Top 0.254: IC1.4 25.77,35.83 25.4,36.2 24.13,37.47 24.13,40.01 26.67,42.55 28.57,44.45 28.57,49.53 27.94,50.16 22.86,50.16 22.23,50.8 22.23,55.24 28.57,61.59 35.56,61.59 v38.73,64.77
  Top 0.406: JP6.5 90.81,68.58 v90.17,67.94
  Route2 0.406: v90.17,67.94 43.81,67.94 40.64,64.77 v38.73,64.77
N$1
  Top 0.406: LED1.A R33.1
N$2
  Top 0.406: R1.1 JP2.2
N$3
  Top 0.406: R2.1 JP2.4
N$4
  Top 0.406: R3.1 JP2.6
N$5
  Top 0.406: R4.1 JP2.8
N$6
  Top 0.406: R8.1 JP2.10
N$7
  Top 0.406: R7.1 JP2.12
N$8
  Top 0.406: R5.1 JP2.14
N$9
  Top 0.406: R6.2 JP2.16
N$10
  Top 0.406: R9.1 JP3.2
N$11
  Top 0.406: R10.1 JP3.4
N$12
  Top 0.406: R11.1 JP3.6
N$13
  Top 0.406: R12.1 JP3.8
N$14
  Top 0.406: R16.1 JP3.10
N$15
  Top 0.406: R15.1 JP3.12
N$16
  Top 0.406: R13.1 JP3.14
N$17
  Top 0.406: R14.2 JP3.16
N$18
  Top 0.406: R17.1 JP4.2
N$19
  Top 0.406: JP4.4 R18.1
N$20
  Top 0.406: JP4.6 R19.1
N$21
  Top 0.406: JP4.8 R20.1
N$22
  Top 0.406: JP4.10 R24.1
N$23
  Top 0.406: JP4.12 R23.1
N$24
  Top 0.406: JP4.14 R21.1
N$25
  Top 0.406: JP4.16 R22.2
N$26
  Top 0.254: R25.1 JP5.2
N$27
  Top 0.254: R26.1 JP5.4
N$28
  Top 0.254: R27.1 JP5.6
N$29
  Top 0.254: R28.1 JP5.8
N$30
  Top 0.254: R32.1 JP5.10
N$31
  Top 0.254: JP5.12 R31.1
N$32
  Top 0.254: JP5.14 R29.1
N$33
  Top 0.254: R30.2 JP5.16
N$42
  Top 0.406: LED2.A R34.1
QT-DETECT-GENERAL  (1 unrouted)
RX0
  Bottom 0.406: U1.0 65.41,52.07 66.04,52.7 JP9.3
RX1
  Bottom 0.406: U1.19 JP9.15
RX2
  Bottom 0.406: U1.17 JP9.11
RX3
  Bottom 0.406: U1.15 JP9.7
SDT-SPI0-MISO  (via drill 0.6)
  Top 0.254: IC1.112 44.72,44.08 45.09,44.45 v46.35,44.45
  Top 0.406: JP12.1 SJ4.2 SJ4.1 U1.50
  Route15 0.254: v46.35,44.45 47.62,44.45
  Route15 0.406: JP12.1 80.01,13.97 79.38,14.61 79.38,17.78 80.64,19.05 88.9,19.05 91.44,21.59 91.44,47.62 90.17,48.9 64.77,48.9 64.14,48.26 64.14,41.27 62.23,39.37 56.52,39.37 55.88,40.01 55.88,41.27 52.7,44.45 v46.35,44.45
SDT-SPI0-MOSI  (via drill 0.6)
  Top 0.254: IC1.111 45.22,42.67 45.72,43.18 v46.35,43.18
  Top 0.406: v90.17,16.51 SJ3.1 SJ3.2 JP13.1
  Route2 0.254: v46.35,43.18 47.62,43.18
  Route2 0.406: JP13.1 87.63,16.51 92.08,20.95 92.08,48.26 90.81,49.53 64.14,49.53 63.5,48.9 63.5,42.55 62.87,41.91 56.52,41.91 55.24,43.18 v46.35,43.18
  Bottom 0.406: U1.51 98.42,13.97 99.06,13.34 99.06,7.62 97.79,6.35 92.71,6.35 90.17,8.89 v90.17,16.51
SDT-SPI0-SCK  (via drill 0.6)
  Top 0.254: IC1.113 44.22,45.48 44.45,45.72 v46.35,45.72
  Top 0.406: JP11.1 SJ2.2 SJ2.1 U1.52
  Route15 0.254: v46.35,45.72 47.62,45.72
  Route15 0.406: JP11.1 90.81,11.43 92.08,12.7 92.08,48.26 90.81,49.53 64.14,49.53 63.5,48.9 63.5,42.55 62.87,41.91 56.52,41.91 55.24,43.18 52.7,45.72 v46.35,45.72
SDT-SPI0-SS  (via drill 0.6)
  Top 0.254: IC1.110 45.72,41.27 v46.35,41.91
  Top 0.406: JP10.1 SJ1.2 SJ1.1 90.17,8.89 90.81,8.26 92.71,6.35 97.79,6.35 99.06,7.62 99.06,10.79 98.42,11.43 97.79,11.43 U1.53
  Route2 0.254: v46.35,41.91 47.62,41.91
  Route2 0.406: JP10.1 80.01,8.89 79.38,9.53 79.38,17.78 80.64,19.05 88.9,19.05 91.44,21.59 91.44,47.62 90.17,48.9 64.77,48.9 64.14,48.26 64.14,41.27 62.23,39.37 56.52,39.37 55.88,40.01 55.88,41.27 55.24,41.91 v46.35,41.91
SDT-USART0-RXD  (1 unrouted)
  Bottom 0.406: JP9.16 81.28,60.96 80.64,61.59 76.83,61.59 76.2,60.96 | 76.2,60.96 75.56,61.59 71.75,61.59 71.12,60.96 | 71.12,60.96 70.48,61.59 66.67,61.59 66.04,60.96 JP9.4 | 71.12,60.96 JP9.8 | 76.2,60.96 JP9.12
SDT-USART0-TXD  (1 unrouted)
  Top 0.406: JP9.2 63.5,60.96 64.14,61.59 67.94,61.59 68.58,60.96 | 68.58,60.96 69.22,61.59 73.03,61.59 73.66,60.96 | 73.66,60.96 74.3,61.59 78.11,61.59 78.74,60.96 JP9.14 | JP9.10 73.66,60.96 | JP9.6 68.58,60.96
SHIELD-DATA-TRANSFER-COM-SELECT
  Top 0.254: IC1.109 46.22,39.87 46.35,40.01 46.35,40.64
  Top 0.305: 49.53,50.16 49.53,53.98
  Top 0.406: 46.35,40.64 49.53,43.81 49.53,50.16 | 49.53,53.98 55.24,59.69 JP1.2
SHIELD-DATA-TRANSFER-VISUAL-OUTPUT  (1 unrouted)
SHIELD-DETECT0  (1 unrouted)
SHIELD-DETECT1  (1 unrouted)
SHIELD-DETECT2  (1 unrouted)
SHIELD-DETECT3  (1 unrouted)
SHIELD-DETECT4  (1 unrouted)
SHIELD-DETECT5  (1 unrouted)
SHIELD-DETECT6  (1 unrouted)
SHIELD-DETECT7  (1 unrouted)
SHIELD-DETECT8  (1 unrouted)
SHIELD-DETECT9  (1 unrouted)
SHIELD-DETECT10  (1 unrouted)
SHIELD-DETECT11  (1 unrouted)
SHIELD-DETECT12  (1 unrouted)
SHIELD-DETECT13  (1 unrouted)
SHIELD-DETECT14  (1 unrouted)
SHIELD-DETECT15  (1 unrouted)
SHIELD-DETECT16  (1 unrouted)
SHIELD-DETECT17  (1 unrouted)
SHIELD-DETECT18  (1 unrouted)
SHIELD-DETECT19  (1 unrouted)
SHIELD-DETECT20  (1 unrouted)
SHIELD-DETECT21  (1 unrouted)
SHIELD-DETECT22  (1 unrouted)
SHIELD-DETECT23  (1 unrouted)
SHIELD-DETECT24  (1 unrouted)
SHIELD-DETECT25  (1 unrouted)
SHIELD-DETECT26  (1 unrouted)
SHIELD-DETECT27  (1 unrouted)
SHIELD-DETECT28  (1 unrouted)
SHIELD-DETECT29  (1 unrouted)
SHIELD-DETECT30  (1 unrouted)
SHIELD-DETECT31  (1 unrouted)
SNS0  (via drill 0.6)
  Top 0.254: IC1.140 30.71,24.53 v32.38,22.86 | C1.1 19.05,21.59 19.68,20.95 20.95,20.95 v23.5,20.95
  Route2 0.254: v32.38,22.86 31.75,23.5 24.77,23.5 24.13,22.86 24.13,21.59 v23.5,20.95
SNS1  (via drill 0.6)
  Top 0.254: IC1.141 30.21,23.12 v31.11,22.23 | C2.1 19.68,19.05 20.32,18.41 v23.5,18.41
  Route2 0.254: v31.11,22.23 30.48,22.86 26.04,22.86 25.4,22.23 25.4,20.32 v23.5,18.41
SNS2  (via drill 0.6)
  Top 0.254: IC1.143 29.21,22.22 v29.84,21.59 | C3.1 23.5,16.51 25.4,18.41 v25.4,19.05
  Route2 0.254: v29.84,21.59 27.3,19.05 v25.4,19.05
SNS3
  Top 0.254: IC1.144 28.71,19.82 27.3,18.41 26.67,18.41 26.04,18.41 25.4,17.78 24.13,16.51 23.5,15.88 19.68,15.88 18.41,14.61 18.41,13.97 C4.1
SNS4  (via drill 0.6)
  Top 0.254: IC1.7 25.36,34.33 24.77,34.92 24.13,35.56 23.5,36.2 22.86,36.83 v22.23,37.47 | C5.1 18.41,11.43 19.05,12.06 v19.05,12.7
  Route2 0.254: v22.23,37.47 20.32,37.47 19.05,36.2 19.05,30.48 20.32,29.21 20.32,24.77 20.32,15.88 19.05,14.61 v19.05,12.7
SNS5  (via drill 0.6)
  Top 0.254: IC1.8 25.23,33.83 24.13,34.92 23.5,35.56 22.86,36.2 v22.23,36.2 | C6.1 19.68,8.89 20.32,9.53 v20.32,12.7
  Route2 0.254: v22.23,36.2 20.95,34.92 20.95,15.24 20.32,14.61 v20.32,12.7
SNS6  (via drill 0.6)
  Top 0.254: IC1.9 24.46,33.33 v22.86,34.92 | C7.1 20.95,6.35 21.59,6.99 v21.59,12.7
  Route2 0.254: v22.86,34.92 22.23,34.92 21.59,34.29 v21.59,12.7
SNS7  (via drill 0.6)
  Top 0.254: IC1.10 23.69,32.83 v22.86,33.66 | C8.1 22.23,1.27 22.86,1.91 v22.86,12.7
  Route2 0.254: v22.86,33.66 22.86,23.5 22.23,22.86 22.23,21.59 22.23,14.61 22.86,13.97 v22.86,12.7
SNS8
  Top 0.254: IC1.11 22.92,32.33 21.59,33.66 21.59,40.64 20.32,41.91 C9.1
SNS9
  Top 0.254: IC1.12 22.15,31.82 20.95,33.02 20.95,38.1 19.68,39.37 C10.1
SNS10
  Top 0.254: IC1.13 21.38,31.32 20.32,32.38 20.32,35.56 19.05,36.83 C11.1
SNS11
  Top 0.254: IC1.14 20.61,30.82 19.68,31.75 19.68,33.66 19.05,34.29 C12.1
SNS12
  Top 0.254: IC1.15 19.84,30.32 18.41,31.75 C13.1
SNS13
  Top 0.254: IC1.16 19.07,29.82 19.05,29.84 18.41,29.21 C14.1
SNS14
  Top 0.254: IC1.17 19.8,29.32 19.05,28.57 19.05,27.3 18.41,26.67 C15.1
SNS15
  Top 0.254: IC1.18 22.48,28.82 22.23,28.57 22.23,27.94 22.23,26.67 21.59,26.04 20.32,26.04 19.68,25.4 19.68,24.77 19.05,24.13 18.41,24.13 C16.1
SNS16  (via drill 0.6)
  Top 0.254: IC1.19 24.52,28.32 v24.13,27.94 | v19.68,62.23 C17.1
  Route2 0.254: v24.13,27.94 24.13,37.47 22.23,39.37 22.23,41.27 21.59,41.91 20.95,42.55 20.95,45.09 19.68,46.35 19.68,48.9 v19.68,62.23
SNS17  (via drill 0.6)
  Top 0.254: IC1.20 25.29,27.82 v24.13,26.67 | v20.95,59.69 C18.1
  Route2 0.254: v24.13,26.67 25.4,27.94 25.4,28.57 24.77,29.21 24.77,37.47 24.77,38.1 22.86,40.01 22.86,41.91 22.23,42.55 22.23,45.09 20.32,46.99 20.32,59.05 v20.95,59.69
SNS18
  Top 0.254: IC1.57 38.72,15.22 38.72,14.59 38.1,13.97 C19.1
SNS19
  Top 0.254: IC1.58 39.22,13.81 38.73,13.34 37.47,12.06 C20.1
SNS20
  Top 0.254: IC1.59 39.72,13.68 38.1,12.06 37.47,11.43 37.09,11.06 C21.1
SNS21
  Top 0.254: IC1.60 40.22,13.54 40.22,12.91 40.01,12.7 38.1,10.79 38.1,9.53 37.47,8.89 C22.1
SNS22
  Top 0.254: IC1.61 40.72,10.23 40.64,10.16 40.64,8.26 40.01,7.62 39.37,7.62 38.73,7.62 C23.1
SNS23
  Top 0.254: IC1.62 41.22,8.83 41.22,6.92 40.64,6.35 C24.1
SNS24
  Top 0.254: IC1.63 41.72,7.42 41.72,7.18 41.91,6.99 C25.1
SNS25
  Top 0.254: IC1.64 42.22,9.86 43.18,8.89 C26.1
SNS26
  Top 0.254: IC1.65 42.72,11.26 43.81,10.16 C27.1
SNS27
  Top 0.254: IC1.66 43.22,12.03 43.81,11.43 C28.1
SNS28
  Top 0.254: IC1.67 43.72,13.44 44.45,12.7 C29.1
SNS29
  Top 0.254: IC1.68 44.22,14.21 44.45,13.97 C30.1
SNS30
  Top 0.254: IC1.69 44.72,15.61 45.09,15.24 C31.1
SNS31
  Top 0.254: IC1.70 45.22,17.02 45.72,16.51 C32.1
SNSK0  (via drill 0.6)
  Top 0.254: C1.2 12.06,21.59 v11.43,22.23 | IC1.71 45.72,19.05 45.09,19.68 41.91,19.68 38.73,22.86 34.29,22.86 v33.66,23.5
  Top 0.406: R1.2 C1.2
  Route15 0.254: v11.43,22.23 14.61,25.4 18.41,25.4 19.68,24.13 33.02,24.13 v33.66,23.5
SNSK1  (via drill 0.6)
  Top 0.254: IC1.72 48.06,17.98 v48.26,17.78 | C2.2 12.06,19.05 | 10.79,19.05 12.06,20.32 19.05,20.32 19.68,19.68 v23.5,19.68
  Top 0.406: R2.2 10.79,19.05 C2.2
  Route2 0.254: v32.38,20.95 33.66,19.68 36.83,19.68 38.1,20.95 41.27,20.95 41.91,20.32 43.18,20.32 46.35,17.14 47.62,17.14 v48.26,17.78
  Route15 0.254: v23.5,19.68 24.13,19.68 24.77,20.32 25.4,20.32 29.84,20.32 30.48,20.95 v32.38,20.95
SNSK2  (via drill 0.6)
  Top 0.254: C3.2 12.06,16.51 | 10.79,16.51 12.06,17.78 v19.05,17.78 | IC1.73 48.76,19.82 49.53,19.05 v49.53,17.78
  Top 0.406: R3.2 10.79,16.51 C3.2
  Route2 0.254: v35.56,21.59 36.83,22.86 46.35,22.86 46.99,22.23 46.99,20.32 v49.53,17.78
  Route15 0.254: v19.05,17.78 19.68,17.14 20.32,17.14 23.5,17.14 24.13,17.78 29.21,17.78 30.48,17.78 32.38,19.68 34.29,19.68 35.56,20.95 v35.56,21.59
SNSK3  (via drill 0.6)
  Top 0.254: v50.8,18.41 48.89,20.32 IC1.74 | C4.2 12.06,13.97 v11.43,14.61
  Top 0.406: R4.2 C4.2
  Route2 0.254: v25.4,16.51 26.67,16.51 27.94,15.24 28.57,14.61 43.81,14.61 44.45,15.24 45.09,15.88 48.9,15.88 50.8,17.78 v50.8,18.41
  Route15 0.254: v11.43,14.61 12.06,15.24 22.86,15.24 24.13,16.51 v25.4,16.51
SNSK4  (via drill 0.6)
  Top 0.254: 10.79,11.43 12.06,12.7 17.78,12.7 19.05,13.97 22.86,13.97 v24.13,15.24 | IC1.77 45.95,21.82 v45.72,21.59
  Top 0.406: R8.2 10.79,11.43 C5.2
  Route2 0.254: v24.13,15.24 26.67,15.24 27.94,13.97 40.01,13.97 40.64,13.34 40.64,10.16 40.01,9.53 v39.37,9.53
  Route15 0.254: v39.37,9.53 40.01,9.53 44.45,13.97 44.45,15.88 44.45,20.32 v45.72,21.59
SNSK5  (via drill 0.6)
  Top 0.254: IC1.78 45.19,22.32 v44.45,21.59 | C6.2 12.06,8.89 v11.43,9.53
  Top 0.406: R7.2 C6.2
  Route2 0.254: v25.4,12.06 26.04,12.7 28.57,12.7 29.21,13.34 36.83,13.34 38.1,12.06 v39.37,10.79
  Route15 0.254: v11.43,9.53 12.06,10.16 24.77,10.16 25.4,10.79 v25.4,12.06 | v39.37,10.79 39.37,13.97 43.18,17.78 43.18,20.32 v44.45,21.59
SNSK6  (via drill 0.6)
  Top 0.254: IC1.79 44.41,22.82 v43.18,21.59 | C7.2 15.61,5.34 16.51,4.45 v21.59,4.45
  Top 0.406: R5.2 C7.2
  Route15 0.254: v21.59,4.45 24.13,4.45 38.73,19.05 40.64,19.05 v43.18,21.59
SNSK7  (via drill 0.6)
  Top 0.254: C8.2 9.26,2.27 9.79,2.81 R6.1 10.79,3.81 11.43,4.45 v11.43,5.08 | IC1.80 43.65,23.32 v41.91,21.59
  Route15 0.254: v11.43,5.08 11.43,6.99 12.06,7.62 24.13,7.62 31.75,15.24 33.02,16.51 33.66,16.51 36.2,19.05 36.83,19.05 37.47,19.05 38.1,19.68 40.01,19.68 v41.91,21.59
SNSK8  (via drill 0.6)
  Top 0.254: IC1.81 42.88,23.82 39.04,23.82 32.38,30.48 31.75,31.11 v31.75,34.92 | C9.2 12.06,41.91 v11.43,42.55
  Top 0.406: R9.2 C9.2
  Route15 0.254: v11.43,42.55 12.06,43.18 23.5,43.18 v31.75,34.92
SNSK9  (via drill 0.6)
  Top 0.254: IC1.82 42.1,24.32 39.81,24.32 32.38,31.75 32.38,33.02 v33.02,33.66 | C10.2 12.06,39.37 v11.43,40.01
  Top 0.406: R10.2 C10.2
  Route15 0.254: v11.43,40.01 12.06,40.64 18.41,40.64 19.05,40.01 20.95,40.01 24.77,40.01 25.4,40.01 31.75,33.66 v33.02,33.66
SNSK10  (via drill 0.6)
  Top 0.254: IC1.83 41.34,24.82 40.58,24.82 33.66,31.75 v33.66,32.38 | C11.2 12.06,36.83 v11.43,37.47
  Top 0.406: R11.2 C11.2
  Route15 0.254: v11.43,37.47 12.06,38.1 20.95,38.1 21.59,38.73 25.4,38.73 26.04,38.1 31.75,32.38 v33.66,32.38
SNSK11  (via drill 0.6)
  Top 0.254: IC1.84 41.35,25.32 38.1,28.57 v38.1,33.66 | C12.2 12.06,34.29 v11.43,34.92
  Top 0.406: R12.2 C12.2
  Route15 0.254: v11.43,34.92 12.06,35.56 18.41,35.56 22.86,31.11 25.4,31.11 26.04,30.48 34.92,30.48 v38.1,33.66
SNSK12  (via drill 0.6)
  Top 0.254: IC1.85 42.12,25.82 39.37,28.57 v39.37,32.38 | C13.2 12.06,31.75 v11.43,32.38
  Top 0.406: R16.2 C13.2
  Route15 0.254: v11.43,32.38 12.06,33.02 18.41,33.02 20.95,30.48 25.4,30.48 26.04,29.84 36.83,29.84 v39.37,32.38
SNSK13  (via drill 0.6)
  Top 0.254: IC1.86 42.89,26.32 40.64,28.57 v40.64,31.11 | C14.2 12.06,29.21 v11.43,29.84
  Top 0.406: R15.2 C14.2
  Route15 0.254: v11.43,29.84 12.06,30.48 18.41,30.48 19.05,29.84 25.4,29.84 26.04,29.21 38.73,29.21 v40.64,31.11
SNSK14  (via drill 0.6)
  Top 0.254: IC1.87 43.66,26.82 41.91,28.57 v41.91,29.84 | C15.2 12.06,26.67 13.34,25.4 18.41,25.4 v19.05,26.04
  Top 0.406: R13.2 12.06,26.67 C15.2
  Route2 0.254: v41.91,29.84 41.27,29.21 36.83,24.77 25.4,24.77 24.77,24.77 v24.13,25.4
  Route15 0.254: v24.13,25.4 19.68,25.4 v19.05,26.04
SNSK15  (via drill 0.6)
  Top 0.254: C16.2 12.06,24.13 v11.43,24.77 | IC1.88 44.43,27.32 v43.18,28.57
  Top 0.406: R14.1 C16.2
  Route15 0.254: v11.43,24.77 15.24,28.57 22.86,28.57 23.5,29.21 25.4,29.21 26.04,28.57 36.2,28.57 v43.18,28.57
SNSK16  (via drill 0.6)
  Top 0.254: R17.2 11.43,62.23 | C17.2 11.43,62.23 | 11.43,62.23 12.7,60.96 v22.23,60.96 | IC1.89 45.2,27.82 44.45,28.57 38.1,34.92 33.66,34.92 v32.38,36.2
  Route2 0.254: v32.38,36.2 27.94,40.64 27.3,41.27 26.04,41.27 24.13,43.18 24.13,44.45 20.95,47.62 20.95,57.78 22.23,59.05 v22.23,60.96
SNSK17  (via drill 0.6)
  Top 0.254: R18.2 11.43,59.69 | C18.2 11.43,59.69 | 11.43,59.69 12.7,58.42 22.23,58.42 v22.86,57.78 | IC1.90 45.97,28.32 45.72,28.57 38.1,36.2 v33.66,36.2
  Route2 0.254: v33.66,36.2 33.66,38.73 29.84,42.55 26.04,42.55 25.4,43.18 25.4,44.45 25.4,45.09 21.59,48.9 21.59,56.52 v22.86,57.78
SNSK18  (via drill 0.6)
  Top 0.254: v16.51,57.15 R19.2 | C19.2 34.29,13.97 33.66,13.34 27.3,13.34 26.67,13.34 24.77,13.34 v24.13,12.7 | IC1.91 46.1,28.82 45.09,29.84 40.64,34.29 v40.64,34.92
  Route2 0.254: v24.13,12.7 24.13,12.06 23.5,11.43 18.41,11.43 17.78,12.06 17.78,42.55 18.41,43.18 19.05,43.81 v19.05,44.45 18.41,45.09 18.41,46.99 18.41,55.24 v16.51,57.15
  Route15 0.254: v40.64,34.92 36.83,34.92 34.92,36.83 34.29,37.47 30.48,37.47 29.21,38.73 23.5,44.45 v19.05,44.45
SNSK19  (via drill 0.6)
  Top 0.254: v27.3,5.71 27.3,11.43 27.94,12.06 28.57,12.7 29.21,12.7 29.84,12.06 C20.2 | R20.2 v12.7,54.61 13.34,55.24 16.51,55.24 19.05,52.7 19.05,50.8 19.68,50.16 20.95,48.9 v22.86,48.9 | IC1.92 46.24,29.32 45.72,29.84 41.91,33.66 v41.91,34.92
  Route2 0.254: v27.3,5.71 15.24,5.71 13.34,7.62 13.34,48.9 12.7,49.53 v12.7,54.61 | v26.67,46.35 24.77,48.26 24.13,48.9 v22.86,48.9
  Route15 0.254: v41.91,34.92 41.91,35.56 41.27,36.2 36.83,36.2 v26.67,46.35
SNSK20  (via drill 0.6)
  Top 0.254: C21.2 33.02,10.16 32.38,10.79 31.75,11.43 31.11,11.43 v29.21,11.43 | R24.2 11.43,52.07 13.97,54.61 16.51,54.61 17.78,53.34 17.78,50.16 v16.51,48.9 17.14,48.26 19.05,48.26 19.68,47.62 25.4,47.62 26.04,48.26 v26.67,48.26 | IC1.93 46.38,29.82 45.72,30.48 43.18,33.02 v43.18,34.92
  Route2 0.254: v29.21,11.43 28.57,10.79 17.14,10.79 16.51,11.43 16.51,43.18 17.78,44.45 17.78,47.62 17.14,48.26 v16.51,48.9
  Route15 0.254: v43.18,34.92 43.18,35.56 42.55,36.2 41.91,36.83 38.1,36.83 v26.67,48.26
SNSK21  (via drill 0.6)
  Top 0.254: v28.57,6.99 28.57,9.53 29.21,10.16 29.84,10.79 31.75,10.79 32.12,10.43 C22.2 | v13.97,49.53 R23.2 | IC1.94 46.51,30.32 45.72,31.11 44.45,32.38 43.81,33.02 43.81,33.66 44.45,34.29 44.45,35.56 v43.81,36.2
  Route2 0.254: v28.57,6.99 15.24,6.99 13.97,8.26 v13.97,49.53
  Route15 0.254: v13.97,49.53 13.97,46.35 14.61,45.72 18.41,45.72 19.05,46.35 20.32,47.62 24.13,47.62 26.04,49.53 27.3,49.53 39.37,37.47 42.55,37.47 43.18,36.83 v43.81,36.2
SNSK22  (via drill 0.6)
  Top 0.254: C23.2 31.75,7.62 31.11,8.26 31.11,8.89 v30.48,9.53 | v15.88,46.99 R21.2 | IC1.95 46.65,30.82 | 46.65,30.82 45.72,31.75 | 46.65,30.82 45.72,31.75 | 45.72,31.75 45.72,32.38 v45.09,33.02 | v26.67,43.81 20.32,43.81 19.68,43.18 17.78,43.18 | 17.78,43.18 17.14,43.81 v16.51,44.45 17.78,43.18
  Route2 0.254: v30.48,9.53 25.4,9.53 24.77,10.16 15.88,10.16 15.24,10.79 15.24,43.18 v16.51,44.45 16.51,46.35 | 16.51,46.35 v15.88,46.99 | v45.09,33.02 40.01,33.02 38.1,34.92 29.21,43.81 27.94,43.81 v26.67,43.81 | 16.51,46.35 v15.88,46.99 | v15.88,46.99 16.51,46.35
SNSK23  (via drill 0.6)
  Top 0.254: C24.2 30.48,6.35 29.84,6.99 v29.84,8.26 | R22.1 v15.24,44.45 15.24,45.09 15.88,45.72 24.13,45.72 24.77,45.09 v26.67,45.09 | IC1.96 46.78,31.32 46.35,31.75 v46.35,33.66
  Route2 0.254: v29.84,8.26 15.24,8.26 14.61,8.89 14.61,43.81 v15.24,44.45 | v46.35,33.66 45.72,34.29 44.45,34.29 43.81,33.66 40.01,33.66 39.37,34.29 28.57,45.09 v26.67,45.09
SNSK24  (via drill 0.6)
  Top 0.254: R25.2 58.79,7.99 57.78,6.99 v51.44,6.99 C25.2 | IC1.97 48.82,31.82 50.16,30.48 v50.16,24.77
  Route2 0.254: v50.16,24.77 51.44,23.5 51.44,22.86 51.44,21.59 53.34,19.68 53.34,18.41 | 53.34,18.41 52.7,17.78 | 52.7,17.78 52.07,17.78 | 52.07,17.78 51.44,17.14 | 53.34,18.41 52.7,17.78 | 52.7,17.78 52.07,17.78 | 52.07,17.78 51.44,17.14 | 51.44,17.14 v51.44,6.99
SNSK25  (via drill 0.6)
  Top 0.254: C26.2 56.52,8.89 57.15,9.53 57.15,15.88 57.78,16.51 | 57.78,16.51 R26.2 | IC1.98 48.95,32.33 50.8,30.48 50.8,26.04 v52.07,24.77 | 57.78,16.51 v57.78,17.78
  Route2 0.254: v57.78,17.78 56.52,17.78 54.61,19.68 54.61,22.23 52.7,24.13 v52.07,24.77
SNSK26  (via drill 0.6)
  Top 0.254: C27.2 55.88,10.16 56.52,10.79 56.52,18.41 v57.15,19.05 57.78,19.05 R27.2 | IC1.99 49.09,32.83 50.8,31.11 52.07,31.11 53.98,33.02 55.24,33.02 55.88,32.38 57.15,32.38 v57.78,33.02
  Route2 0.254: v57.15,19.05 57.15,20.32 57.78,20.95 v57.78,33.02
SNSK27  (via drill 0.6)
  Top 0.254: C28.2 55.24,11.43 55.88,12.06 55.88,20.95 v56.52,21.59 R28.2 | IC1.100 49.23,33.33 50.8,31.75 51.44,31.75 53.34,33.66 v56.52,33.66
  Route2 0.254: v56.52,33.66 56.52,25.4 57.15,24.77 57.15,23.5 56.52,22.86 v56.52,21.59
SNSK28  (via drill 0.6)
  Top 0.254: C29.2 54.61,12.7 55.24,13.34 55.24,23.5 v55.88,24.13 R32.2 | IC1.101 49.99,33.83 v50.8,33.02
  Route2 0.254: v55.88,24.13 55.88,24.77 55.24,25.4 52.7,25.4 52.07,26.04 52.07,28.57 51.44,29.21 51.44,32.38 v50.8,33.02
SNSK29  (via drill 0.6)
  Top 0.254: C30.2 53.98,13.97 54.61,14.61 54.61,26.04 v55.24,26.67 R31.2 | IC1.102 51.47,34.33 v52.07,34.92
  Route2 0.254: v55.24,26.67 55.24,27.94 53.98,29.21 52.7,29.21 52.07,29.84 v52.07,34.92
SNSK30  (via drill 0.6)
  Top 0.254: IC1.105 53.08,35.83 53.34,35.56 54.61,35.56 v55.24,36.2 | R29.2 v55.24,29.21 54.61,29.21 53.98,28.57 53.98,15.88 53.34,15.24 C31.2
  Route2 0.254: v55.24,29.21 v55.24,36.2
SNSK31  (via drill 0.6)
  Top 0.254: C32.2 52.34,17.41 53.34,18.41 53.34,31.11 v53.98,31.75 R30.1 | IC1.106 53.47,36.33 v53.98,36.83
  Route2 0.254: v53.98,36.83 v53.98,31.75
SPI-MISO-ALT
  Bottom 0.406: U1.12 31.5,53.72 31.75,53.98 JP17.1
SPI-MOSI-ALT
  Bottom 0.406: U1.11 34.04,53.72 34.29,53.98 JP16.1
SPI-SCK-ALT
  Bottom 0.406: U1.13 28.96,53.72 29.21,53.98 JP14.1
SPI-SS-ALT
  Bottom 0.406: U1.10 36.58,53.72 36.83,53.98 JP15.1
TOUCH_DATA-MISO  (via drill 0.6)
  Top 0.254: IC1.133 34.22,45.01 34.92,45.72 v36.2,45.72
  Route2 0.254: v36.2,45.72 38.1,47.62 55.24,47.62 55.88,46.99 57.15,46.99 59.05,46.99 JP18.7
TOUCH_DATA-MOSI  (via drill 0.6)
  Top 0.254: IC1.132 34.72,44.24 34.92,44.45 v36.2,44.45
  Route2 0.254: v36.2,44.45 38.73,46.99 52.7,46.99 53.98,46.99 55.24,45.72 55.24,44.45 56.52,43.18 JP18.6
TOUCH_DATA-SCK  (via drill 0.6)
  Top 0.254: IC1.131 35.22,42.84 35.56,43.18 v36.2,43.18
  Route15 0.254: v36.2,43.18 37.47,44.45 37.47,46.35 38.73,47.62 39.37,47.62 54.61,47.62 55.88,46.35 56.52,45.72 JP18.8
TOUCH_DATA-SS  (via drill 0.6)
  Top 0.254: IC1.130 35.72,41.43 v36.2,41.91
  Route15 0.254: JP18.5 59.05,44.45 56.52,44.45 55.88,45.09 53.98,46.99 39.37,46.99 38.1,45.72 38.1,45.09 38.1,43.18 36.83,41.91 v36.2,41.91
TX0
  Bottom 0.406: U1.1 60.96,53.98 61.59,54.61 62.87,54.61 63.5,55.24 JP9.1
TX1
  Bottom 0.406: U1.18 JP9.13
TX2
  Bottom 0.406: U1.16 JP9.9
TX3
  Bottom 0.406: U1.14 JP9.5
VCC  (via drill 0.6)  (9 unrouted)
  Top 0.254: IC1.5 27.7,35.33 27.94,35.56 27.94,38.73 | IC1.75 49.4,20.82 | IC1.118 41.72,40.45 41.91,40.64 42.17,40.91 | IC1.103 45.82,34.83 45.09,35.56 v45.09,36.83 | C45.1 C46.1 | IC1.53 36.72,19.8 36.2,20.32 34.92,20.32 34.29,20.95 v34.29,21.59 | IC1.38 29.21,19.05 29.84,19.68 v30.48,19.68
  Top 0.406: 49.4,20.82 49.53,20.95 C48.1 C47.1 | 42.17,40.91 42.55,41.27 42.88,41.6 C42.1 42.81,43.24 42.81,44.82 C43.1 C44.1 | v52.7,39.37 C45.1 | JP6.4 97.79,71.12 98.42,71.75 98.42,74.93 97.79,75.56 90.17,75.56 86.36,71.75 74.3,71.75 73.66,72.39 R35.1 | v29.21,41.27 28.57,41.27 | 28.57,41.27 27.94,40.64 | 27.94,38.73 27.94,40.64 | 27.94,40.64 28.57,41.27
  Route2 0.406: v45.09,36.83 48.9,38.1 52.07,38.1 52.7,38.73 v52.7,39.37
  Bottom 0.406: v34.29,21.59 34.29,22.23 34.92,22.86 C39.1 32.72,25.07 32.38,25.4 C40.1 C41.1 | v30.48,19.68 C33.1 28.84,21.32 28.57,21.59 C34.1 | C50.1 C49.1 28.57,40.64 v29.21,41.27
VDDCORE  (via drill 0.6)
  Top 0.254: IC1.55 37.72,21.34 v37.47,21.59
  Bottom 0.406: v37.47,21.59 38.1,22.23 C38.1 40.95,23.16 41.27,23.5 C37.1
VDDIN_33  (via drill 0.6)
  Top 0.254: 37.22,16.89 IC1.54
  Top 0.406: v34.29,15.88 36.2,15.88 37.22,16.89
  Bottom 0.406: C36.1 27.3,13.34 27.94,12.7 29.84,12.7 30.15,13.01 C35.1 33.96,13.01 34.29,13.34 34.29,15.24 v34.29,15.88

### Text on the board
Bottom: QTouchShield | Version 0.1 2012-MM-DD | Stuart Cording aka. | /* CODINGHEAD */